# EasyEDA Pro project 长沙理工大学-NFC校园卡.epro

# Schematic Schematic1
Board Name: 编辑板; Create Date: 2025-08-29; Page Name: P1; Project Name: 长沙理工大学-NFC校园卡; Schematic Name: Schematic1; Update Date: 2025-09-23; Company: 嘉立创EDA; Drawed: lune; Page Size: A4; Part Number: lune; Reviewed: lune; Version: V1.0
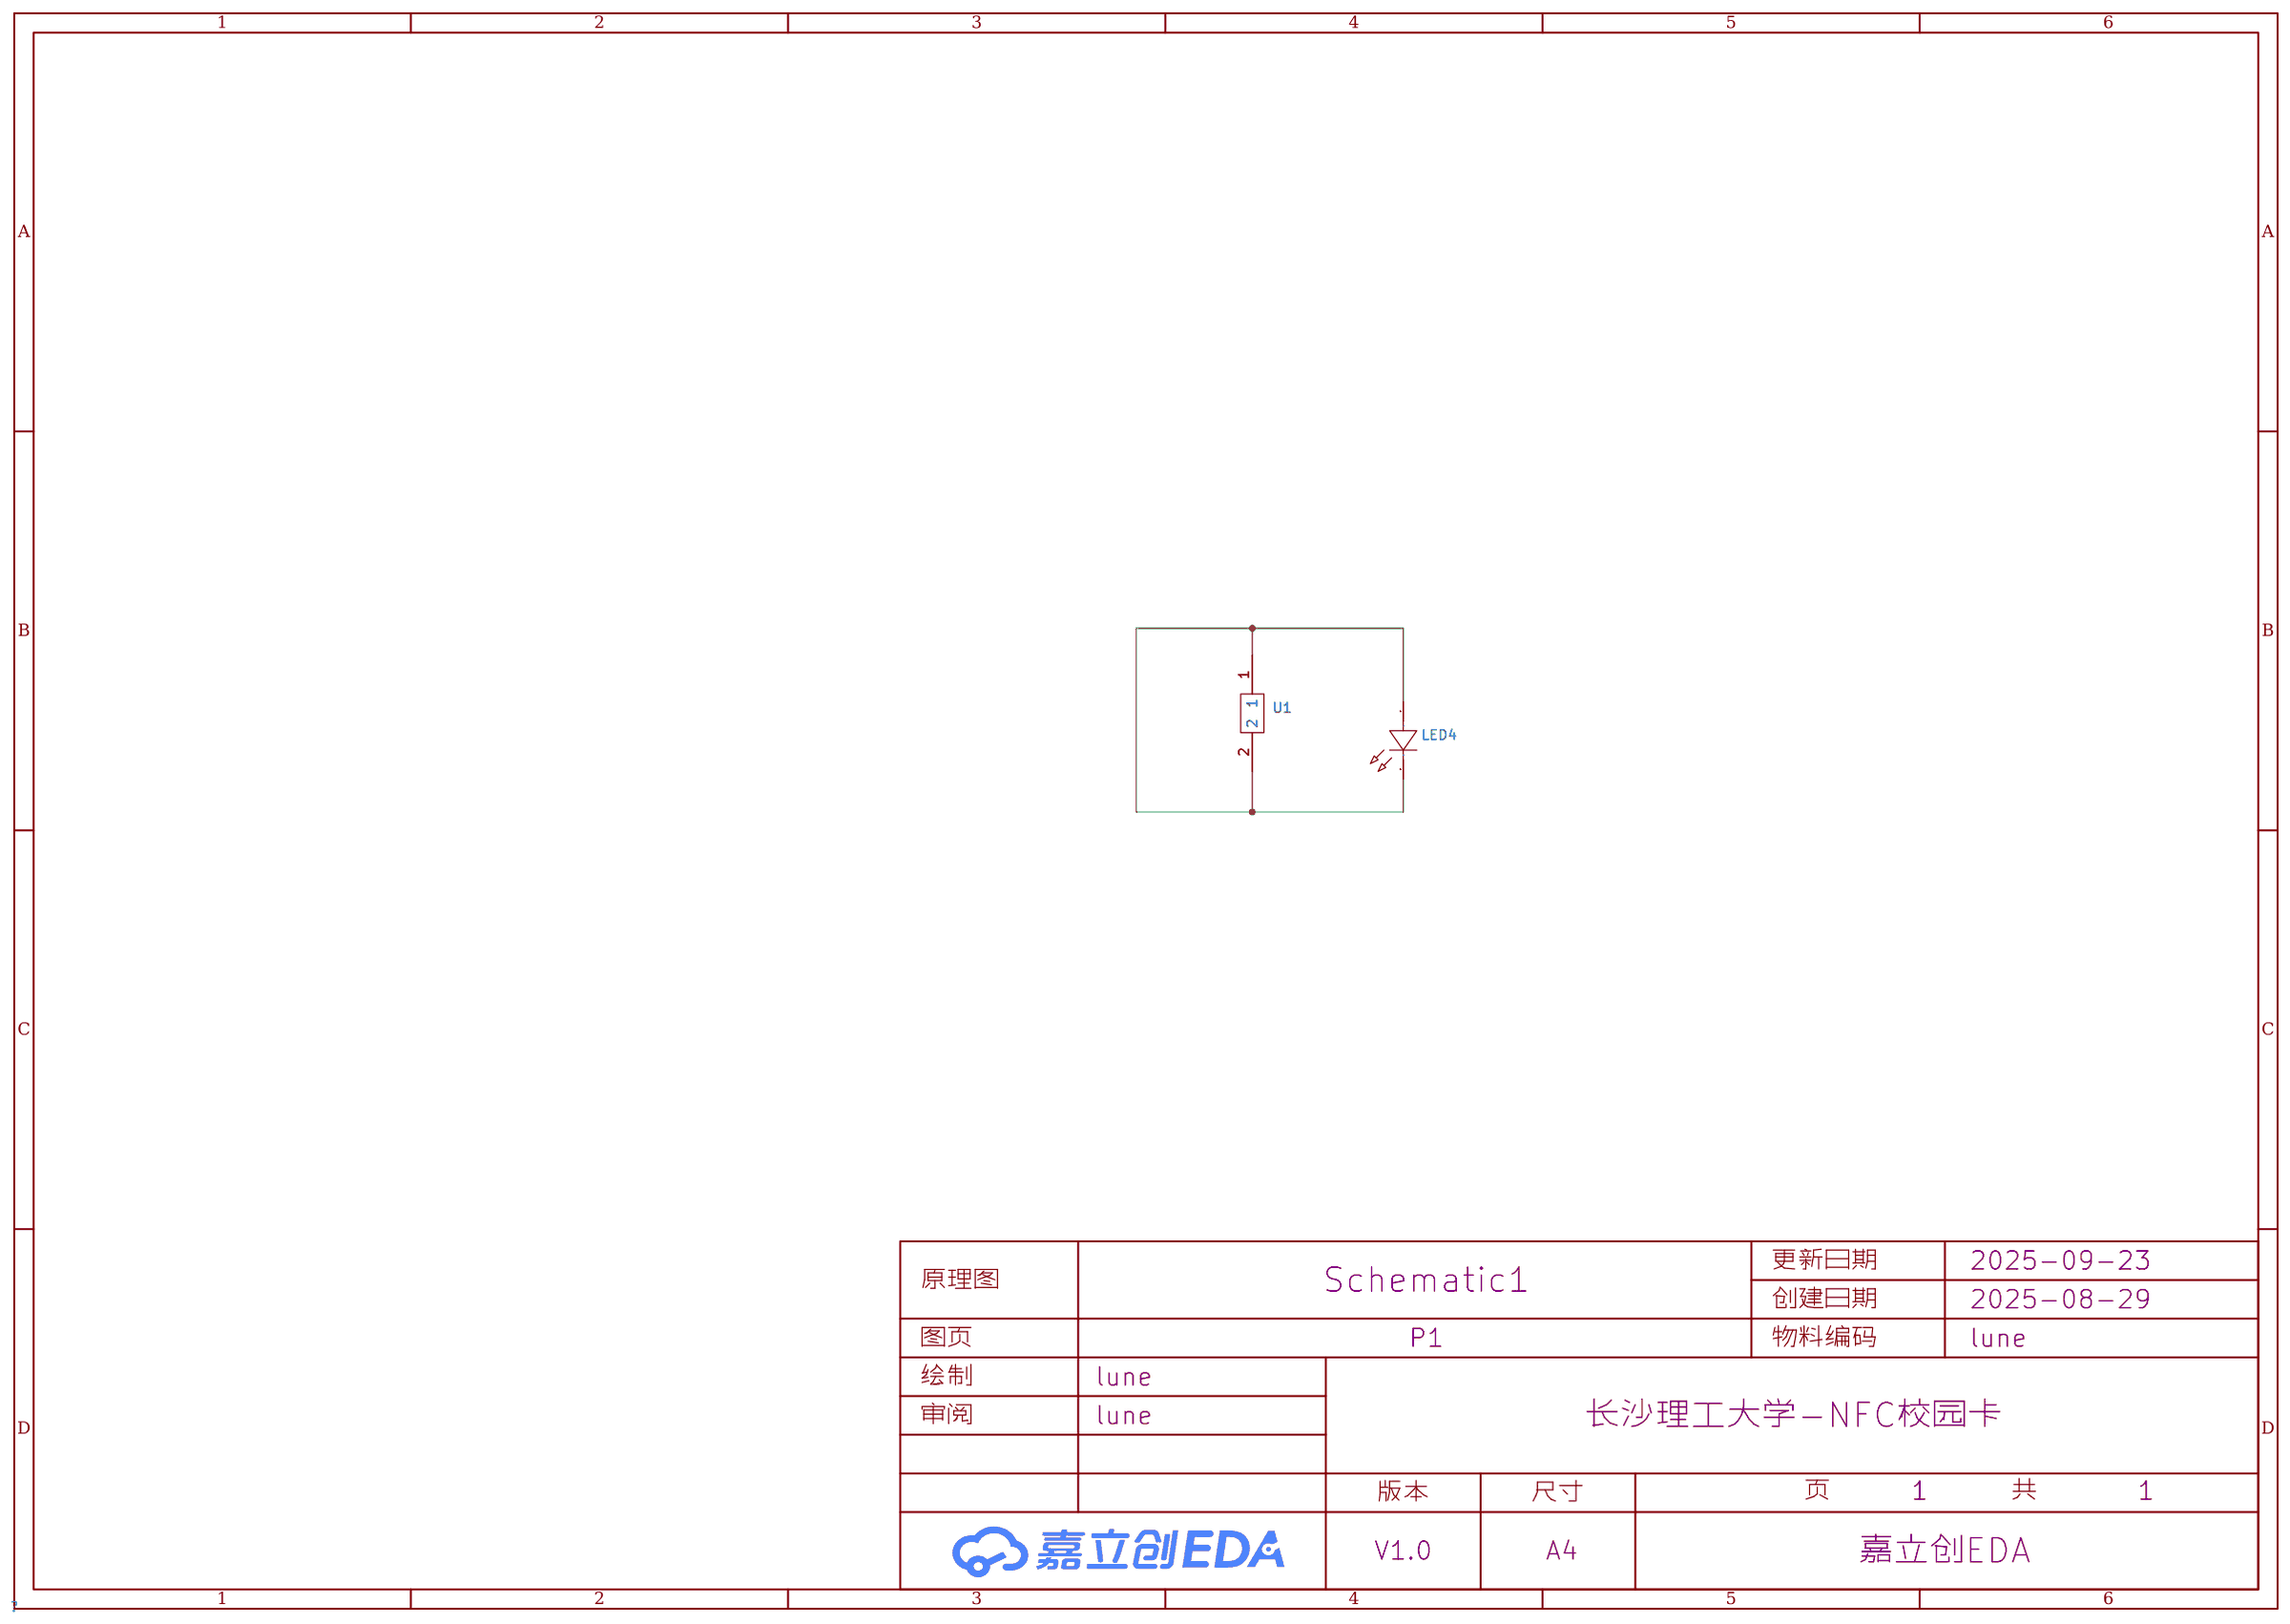
[diagram p0: schematic sheet]

## Parts
LED4  XL-3216SURC  [LED1206-R-RD_RED]
U1  CUID  [CUID芯片5×8mm]

## Library data of the parts
LED4 = XL-3216SURC: 发光颜色:红色;功率:55mW;正向电流:25mA;主波长:617nm~621nm;透镜颜色:无色透明透镜;色温:-;发光角度:120°;载带方式:正贴;工作温度:-30℃~+85℃;; Supplier Part: C965822; Manufacturer: XINGLIGHT(成兴光); Supplier Footprint: 1206; JLCPCB Part Class: 扩展库; Datasheet: https://atta.szlcsc.com/upload/public/pdf/source/20221102/38B682A5E5FDBBFCA7077B6272CE8E6F.pdf; Supplier: LCSC; Emitted Color: 红色; Power Dissipation: 55mW; Forward Current: 25mA; Dominant Wavelength: 617nm~621nm; Peak Wavelength: 623nm; Lens Color: 无色透明透镜; Viewing Angle: 120°; Mounting Sytle: 正贴; Operating Temperature: -30℃~+85℃
U1 = CUID芯片

## Nets
$1N1895: LED4.1(K) LED4.2(A) U1.1 U1.2

# Board PCB1
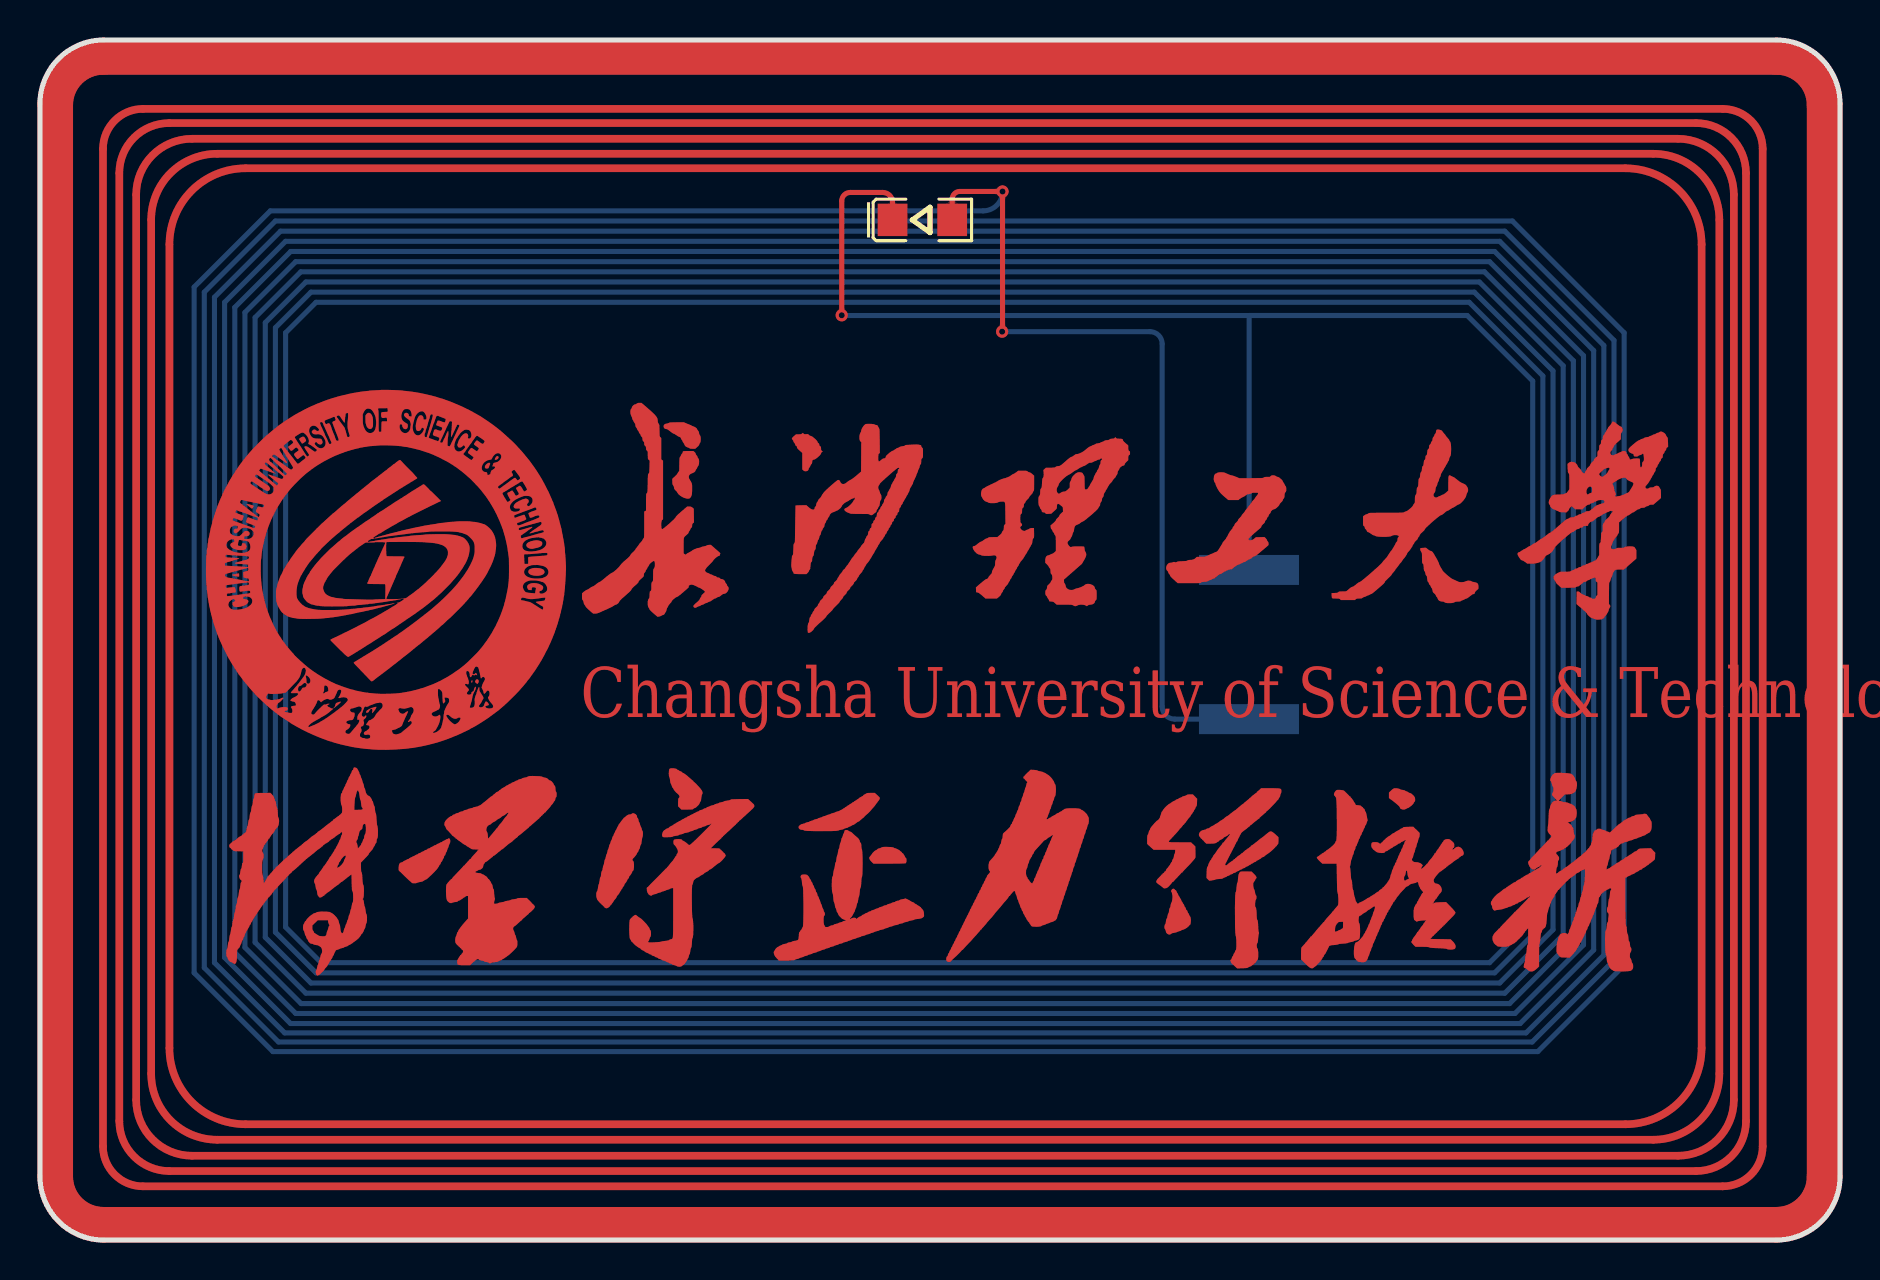
[diagram p1: board, top side]
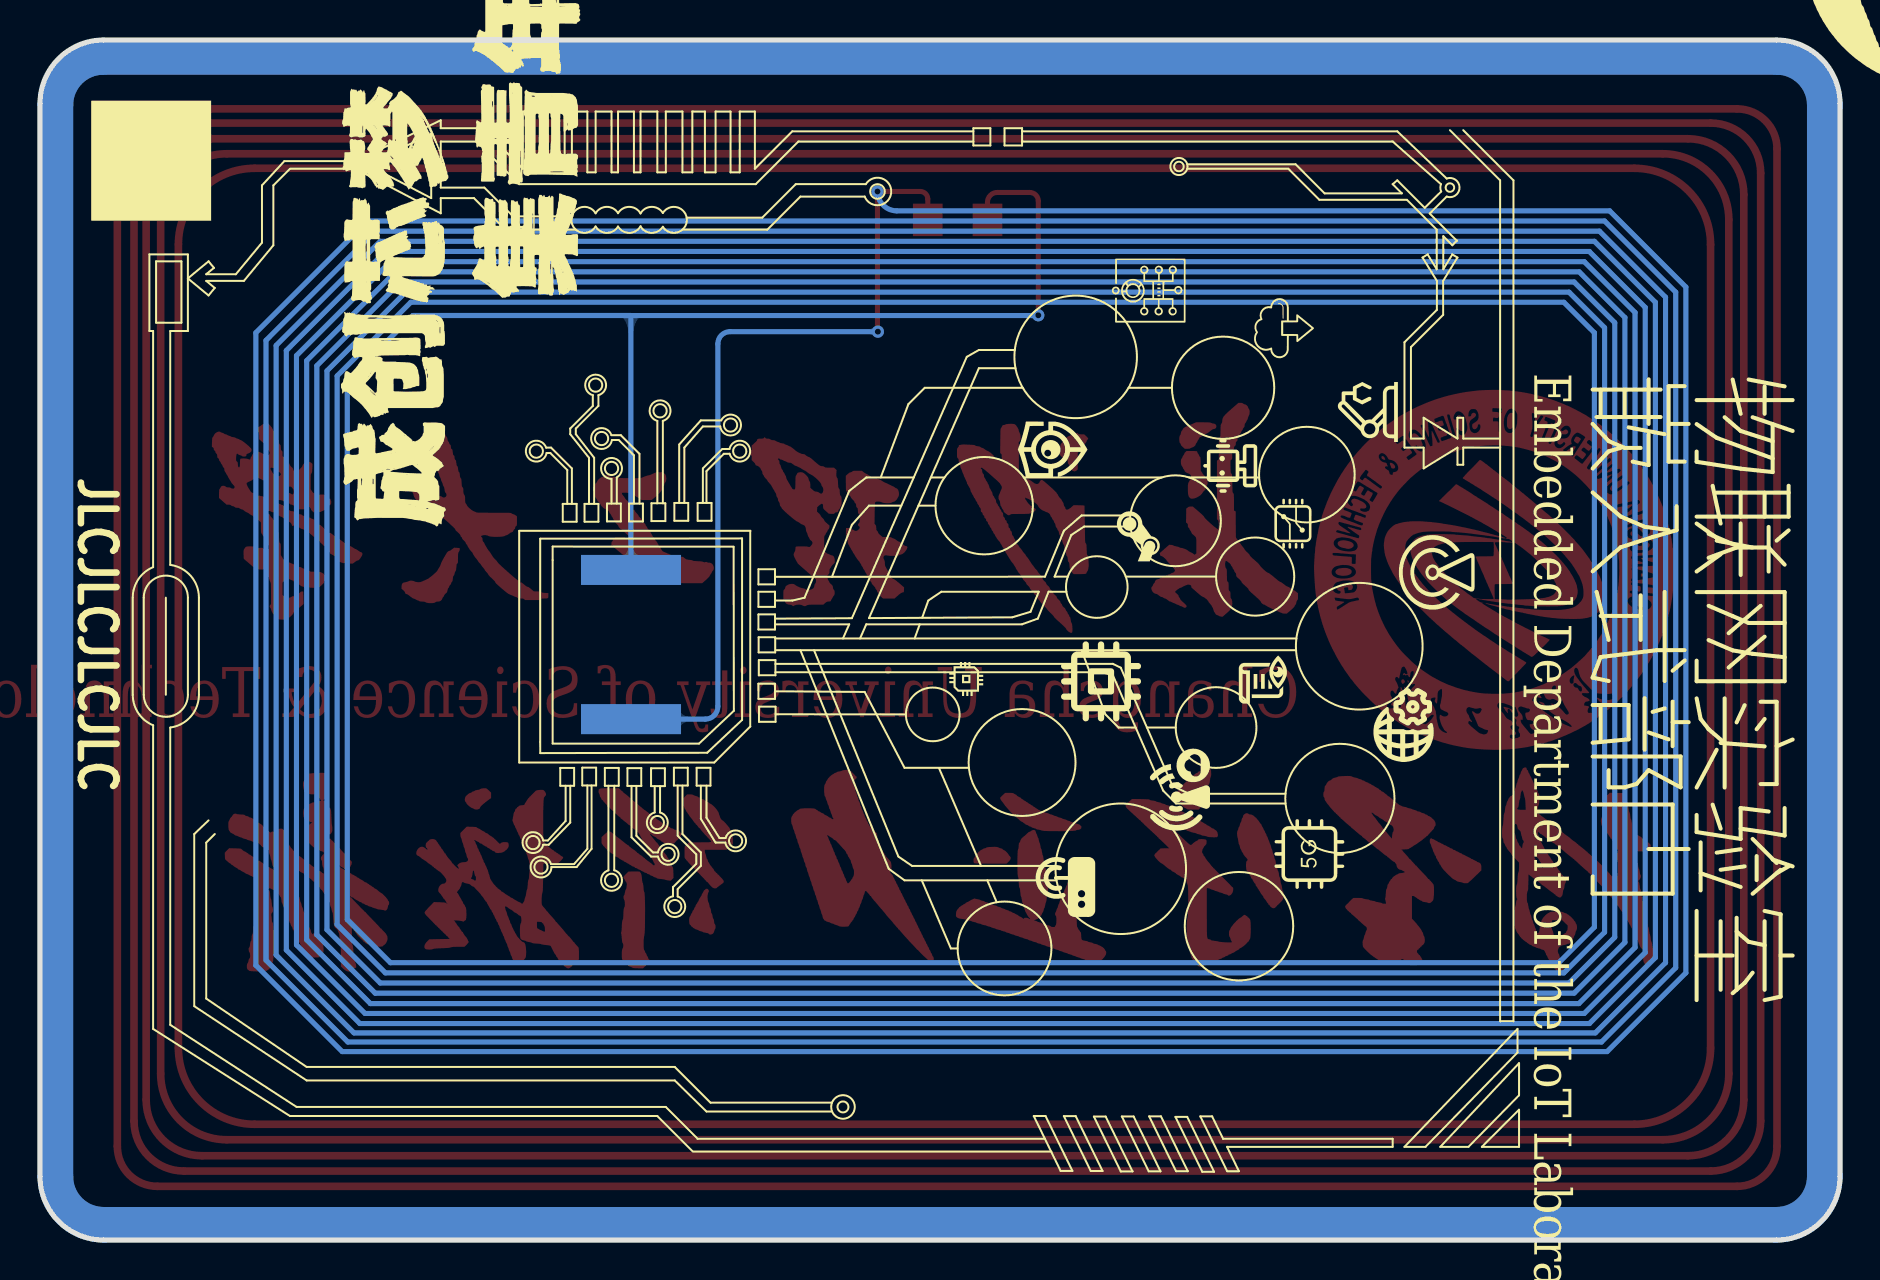
[diagram p2: board, bottom side, seen from below]

Outline 90 x 60 mm; copper layers: Top Layer, Bottom Layer. Coordinates in mm from the lower left corner of the outline.
Outline path: 0,56.82 arc(0.93,59.07) 3.18,60 86.82,60 arc(89.07,59.07) 90,56.82 90,3.18 arc(89.07,0.93) 86.82,0 3.18,0 arc(0.93,0.93) 0,3.18 0,56.82
Stack: Top Layer 0.035mm - / Dielectric1 1.51mm FR4 er 4.5 / Bottom Layer 0.035mm -

## Design rules (mm)
template: 自定义配置
spacing copperThickness1oz (default): track to track 0.203, other pairs 0.203 to 0.203
spacing copperThickness2oz: track to track 0.203, other pairs 0.152 to 0.3
track width copperThickness1oz (default): min 0.127, default 0.254, max 2.54
track width copperThickness2oz: min 0.203, default 0.254, max 2.54
differential pair differentialPair (default): width min 0.127, default 0.254, max 2.54; gap min 0.152, default 0.152
via viaSize (default): diameter min 0.5, default 0.61, max 10; hole min 0.3, default 0.305, max 6.299

## Placement (name value [footprint] x y rotation side)
LED4  XL-3216SURC  [LED1206-R-RD_RED]  44.12 51.01 0 top
U1  CUID  [JLC-QRCODE-6x6]  84.44 53.97 180 bottom
U1#2  -  [CUID芯片5×8mm]  60.45 29.77 90 bottom

## Footprints (pads in the part's own frame, mm; a bottom-side part is the same pattern mirrored in y, then rotated)
CUID芯片5×8mm
  rect 1.5x5 smd: 1(-3.729,0) 2(3.729,0)
LED1206-R-RD_RED
  rect 1.485x1.62 smd: 1(1.492,0) 2(-1.492,0)

## Nets
$1N1895: LED4.1 LED4.2 U1#2.1 U1#2.2

## Via types
v1: diameter 0.61, hole 0.305, Top Layer to Bottom Layer, 3 vias

## Routing (per net, layer and track width the routed paths; a pad name or vN(x,y) marks a point on that pad's centre or on a via; arc(x,y) is an arc through that point)
$1N1895: length 2079.2
  Top Layer w0.254: LED4.2 42.63,51.89 arc(42.48,52.23) 42.14,52.38 40.51,52.38 arc(40.21,52.25) 40.09,51.95 v1(40.09,46.24) ; v1(48.11,45.42) 48.13,45.44 v1(48.13,52.43) 45.99,52.43 arc(45.72,52.32) 45.61,52.05 LED4.1
  Bottom Layer w0.254: 48.09,52.47 48.09,52.47 ; U1#2.1 56.74,26.04 arc(56.29,26.23) 56.11,26.67 56.11,44.81 arc(55.93,45.24) 55.5,45.42 v1(48.11,45.42) ; v1(40.09,46.24) 40.1,46.22 60.46,46.22 ; U1#2.2 60.46,33.51 60.46,46.22 71.36,46.22 74.64,42.95 74.64,16.02 72.48,13.87 14.06,13.87 12.28,15.64 12.28,45.36 13.8,46.89 71.46,46.89 75.14,43.2 75.14,15.77 72.73,13.36 13.8,13.36 11.77,15.39 11.77,45.62 13.55,47.39 71.72,47.39 75.65,43.46 75.65,15.52 72.99,12.85 13.55,12.85 11.26,15.14 11.26,45.87 13.3,47.9 71.97,47.9 76.16,43.71 76.16,15.26 73.24,12.34 13.3,12.34 10.75,14.88 10.75,46.12 13.04,48.41 72.22,48.41 76.67,43.96 76.67,15.01 73.48,11.82 13.05,11.82 10.25,14.63 10.25,46.38 12.79,48.92 72.48,48.92 77.18,44.22 77.18,14.75 73.75,11.33 12.79,11.33 9.74,14.37 9.74,46.63 12.53,49.43 72.73,49.43 77.68,44.47 77.68,14.5 74.01,10.82 12.53,10.82 9.23,14.12 9.23,46.89 12.28,49.93 72.99,49.93 78.19,44.73 78.19,14.25 74.3,10.35 12.23,10.35 8.72,13.87 8.72,47.14 12.03,50.44 73.24,50.44 78.7,44.98 78.7,13.99 74.61,9.9 11.93,9.9 8.22,13.61 8.22,47.39 11.77,50.95 73.62,50.95 79.21,45.36 79.21,13.74 74.89,9.42 11.64,9.42 7.71,13.36 7.71,47.65 11.52,51.46 47.16,51.46 arc(47.84,51.74) v1(48.13,52.43)

Small or netless copper shapes (teardrops, artwork), in the pictures only: 50 on Top Layer, 6 on Bottom Layer

## Text on the board
Bottom Silkscreen Layer: JLCJLCJLCJLC | Embedded Department of the IoT Laboratory | 物联网实验室 | 嵌入式部门
Top Layer: Changsha University of Science & Technology
Top Solder Mask Layer: Changsha University of Science & Technology

# Board 第一版
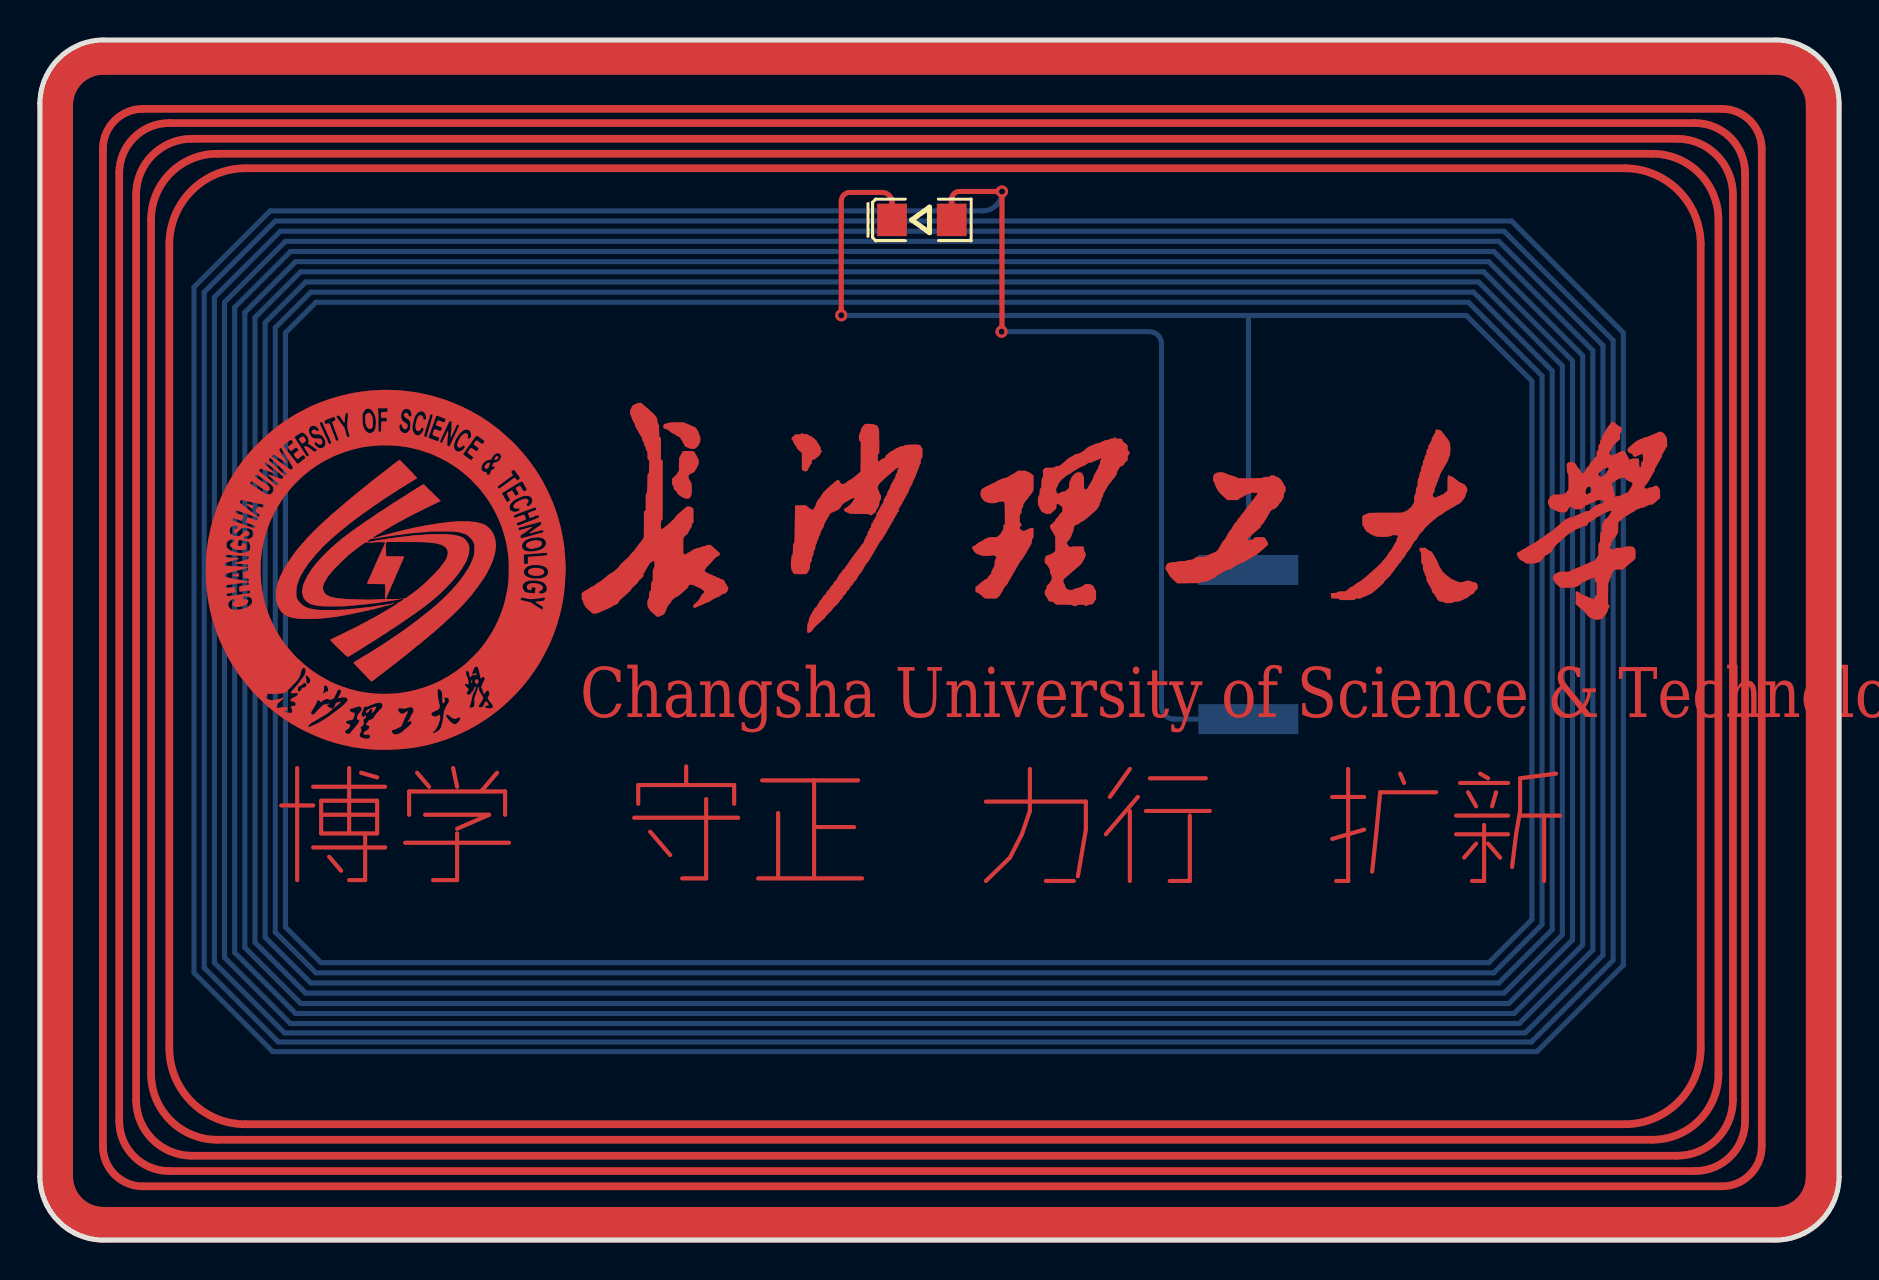
[diagram p3: board, top side]
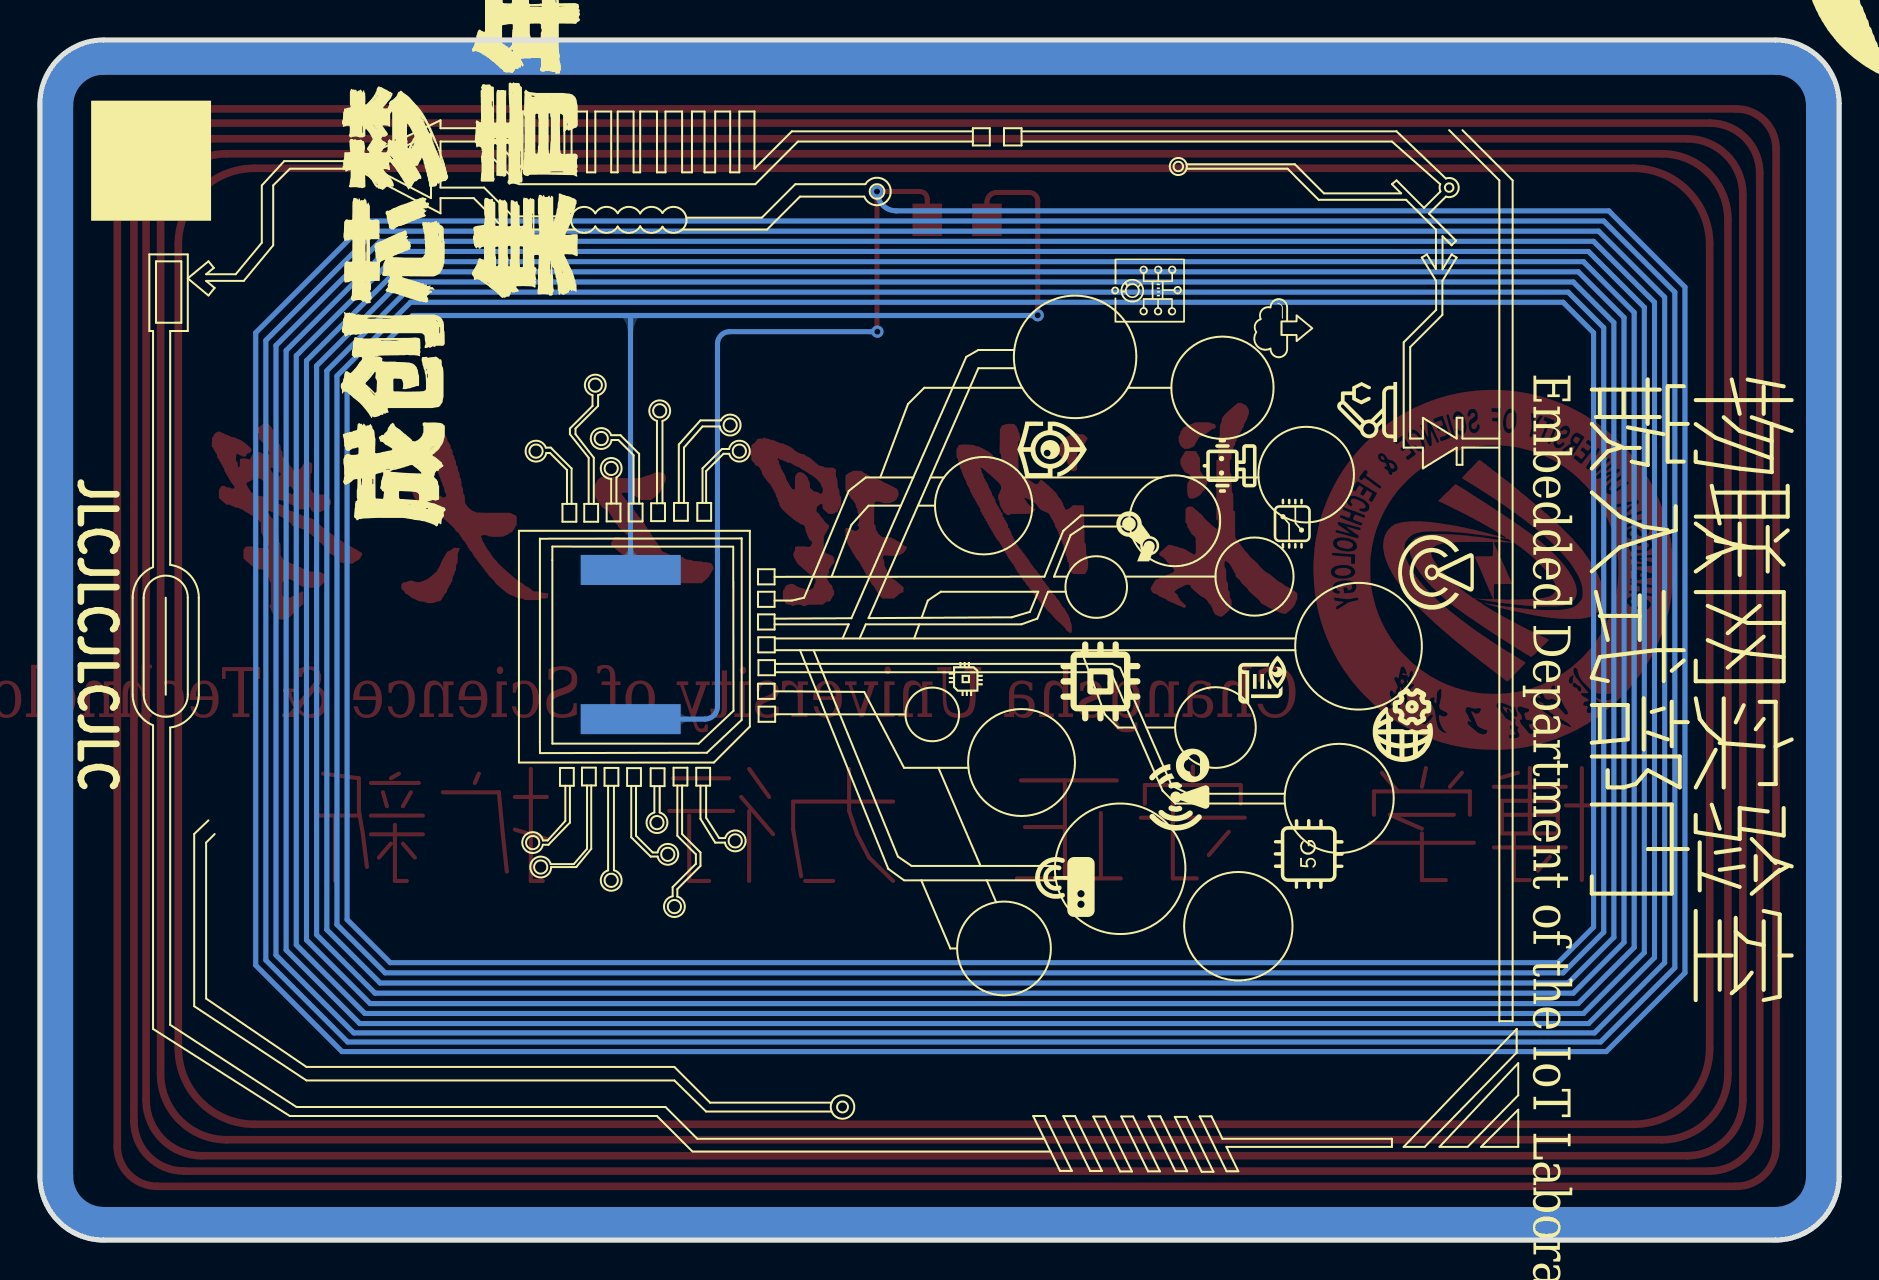
[diagram p4: board, bottom side, seen from below]

Outline 90 x 60 mm; copper layers: Top Layer, Bottom Layer. Coordinates in mm from the lower left corner of the outline.
Outline path: 0,56.82 arc(0.93,59.07) 3.18,60 86.82,60 arc(89.07,59.07) 90,56.82 90,3.18 arc(89.07,0.93) 86.82,0 3.18,0 arc(0.93,0.93) 0,3.18 0,56.82
Stack: Top Layer 0.035mm - / Dielectric1 1.51mm FR4 er 4.5 / Bottom Layer 0.035mm -

## Design rules (mm)
template: 自定义配置
spacing copperThickness1oz (default): track to track 0.203, other pairs 0.203 to 0.203
spacing copperThickness2oz: track to track 0.203, other pairs 0.152 to 0.3
track width copperThickness1oz (default): min 0.127, default 0.254, max 2.54
track width copperThickness2oz: min 0.203, default 0.254, max 2.54
differential pair differentialPair (default): width min 0.127, default 0.254, max 2.54; gap min 0.152, default 0.152
via viaSize (default): diameter min 0.5, default 0.61, max 10; hole min 0.3, default 0.305, max 6.299

## Placement (name value [footprint] x y rotation side)
LED4  XL-3216SURC  [LED1206-R-RD_RED]  44.12 51.01 0 top
U1  -  [CUID芯片5×8mm]  60.45 29.77 90 bottom
U1#2  -  [JLC-QRCODE-6x6]  84.44 53.96 180 bottom

## Footprints (pads in the part's own frame, mm; a bottom-side part is the same pattern mirrored in y, then rotated)
CUID芯片5×8mm
  rect 1.5x5 smd: 1(-3.729,0) 2(3.729,0)
LED1206-R-RD_RED
  rect 1.485x1.62 smd: 1(1.492,0) 2(-1.492,0)

## Nets
$1N1895: LED4.1 LED4.2 U1.1 U1.2

## Via types
v1: diameter 0.61, hole 0.305, Top Layer to Bottom Layer, 3 vias

## Routing (per net, layer and track width the routed paths; a pad name or vN(x,y) marks a point on that pad's centre or on a via; arc(x,y) is an arc through that point)
$1N1895: length 2079.2
  Top Layer w0.254: v1(48.11,45.42) 48.13,45.44 v1(48.13,52.43) 45.99,52.43 arc(45.72,52.31) 45.61,52.05 LED4.1 ; v1(40.09,46.24) 40.09,51.95 arc(40.21,52.25) 40.51,52.38 42.14,52.38 arc(42.48,52.23) 42.63,51.89 LED4.2
  Bottom Layer w0.254: U1.2 60.46,33.51 60.46,46.23 ; v1(48.11,45.42) 55.5,45.42 arc(55.93,45.24) 56.11,44.81 56.11,26.67 arc(56.29,26.23) 56.73,26.04 U1.1 ; 60.46,46.23 40.1,46.23 v1(40.09,46.24) ; 60.46,46.23 71.36,46.23 74.64,42.95 74.64,16.02 72.48,13.87 14.06,13.87 12.28,15.64 12.28,45.36 13.8,46.89 71.46,46.89 75.14,43.2 75.14,15.77 72.73,13.36 13.8,13.36 11.77,15.39 11.77,45.62 13.55,47.39 71.71,47.39 75.65,43.46 75.65,15.52 72.98,12.85 13.55,12.85 11.26,15.14 11.26,45.87 13.29,47.9 71.97,47.9 76.16,43.71 76.16,15.26 73.24,12.34 13.29,12.34 10.75,14.88 10.75,46.12 13.04,48.41 72.22,48.41 76.67,43.96 76.67,15.01 73.48,11.82 13.05,11.82 10.25,14.63 10.25,46.38 12.79,48.92 72.48,48.92 77.18,44.22 77.18,14.75 73.75,11.33 12.79,11.33 9.74,14.37 9.74,46.63 12.53,49.43 72.73,49.43 77.68,44.47 77.68,14.5 74.01,10.82 12.53,10.82 9.23,14.12 9.23,46.89 12.28,49.93 72.98,49.93 78.19,44.73 78.19,14.25 74.3,10.36 12.23,10.36 8.72,13.87 8.72,47.14 12.02,50.44 73.24,50.44 78.7,44.98 78.7,13.99 74.61,9.9 11.93,9.9 8.21,13.61 8.21,47.39 11.77,50.95 73.62,50.95 79.21,45.36 79.21,13.74 74.89,9.42 11.64,9.42 7.71,13.36 7.71,47.65 11.52,51.46 47.16,51.46 arc(47.84,51.74) v1(48.13,52.43) ; 48.09,52.47 48.09,52.47

Small or netless copper shapes (teardrops, artwork), in the pictures only: 33 on Top Layer, 6 on Bottom Layer

## Text on the board
Bottom Silkscreen Layer: JLCJLCJLCJLC | Embedded Department of the IoT Laboratory | 物联网实验室 | 嵌入式部门
Top Layer: Changsha University of Science & Technology | 博学 | 守正 | 力行 | 扩新
Top Solder Mask Layer: Changsha University of Science & Technology | 博学 | 守正 | 力行 | 扩新

# Board 第二版
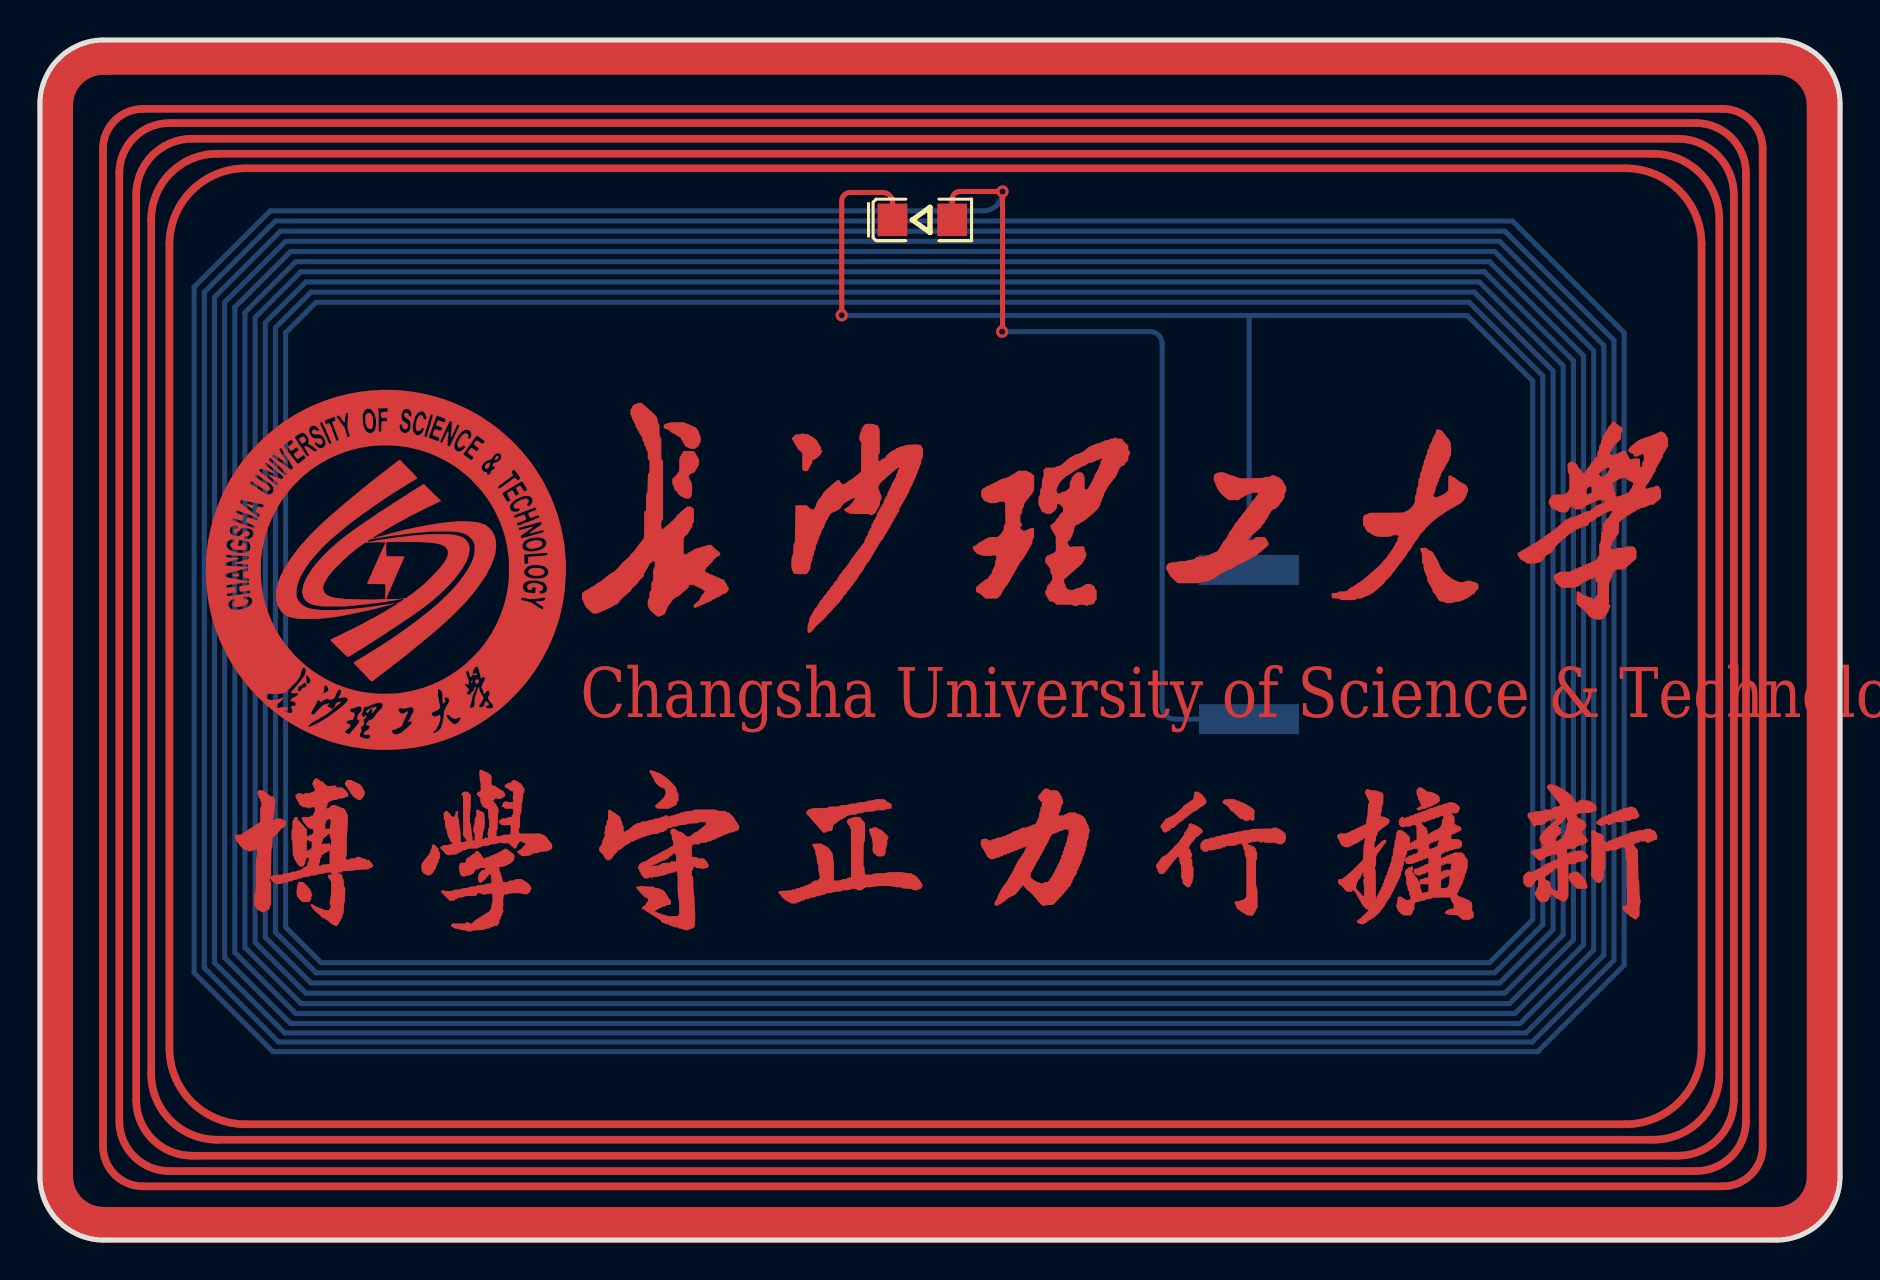
[diagram p5: board, top side]
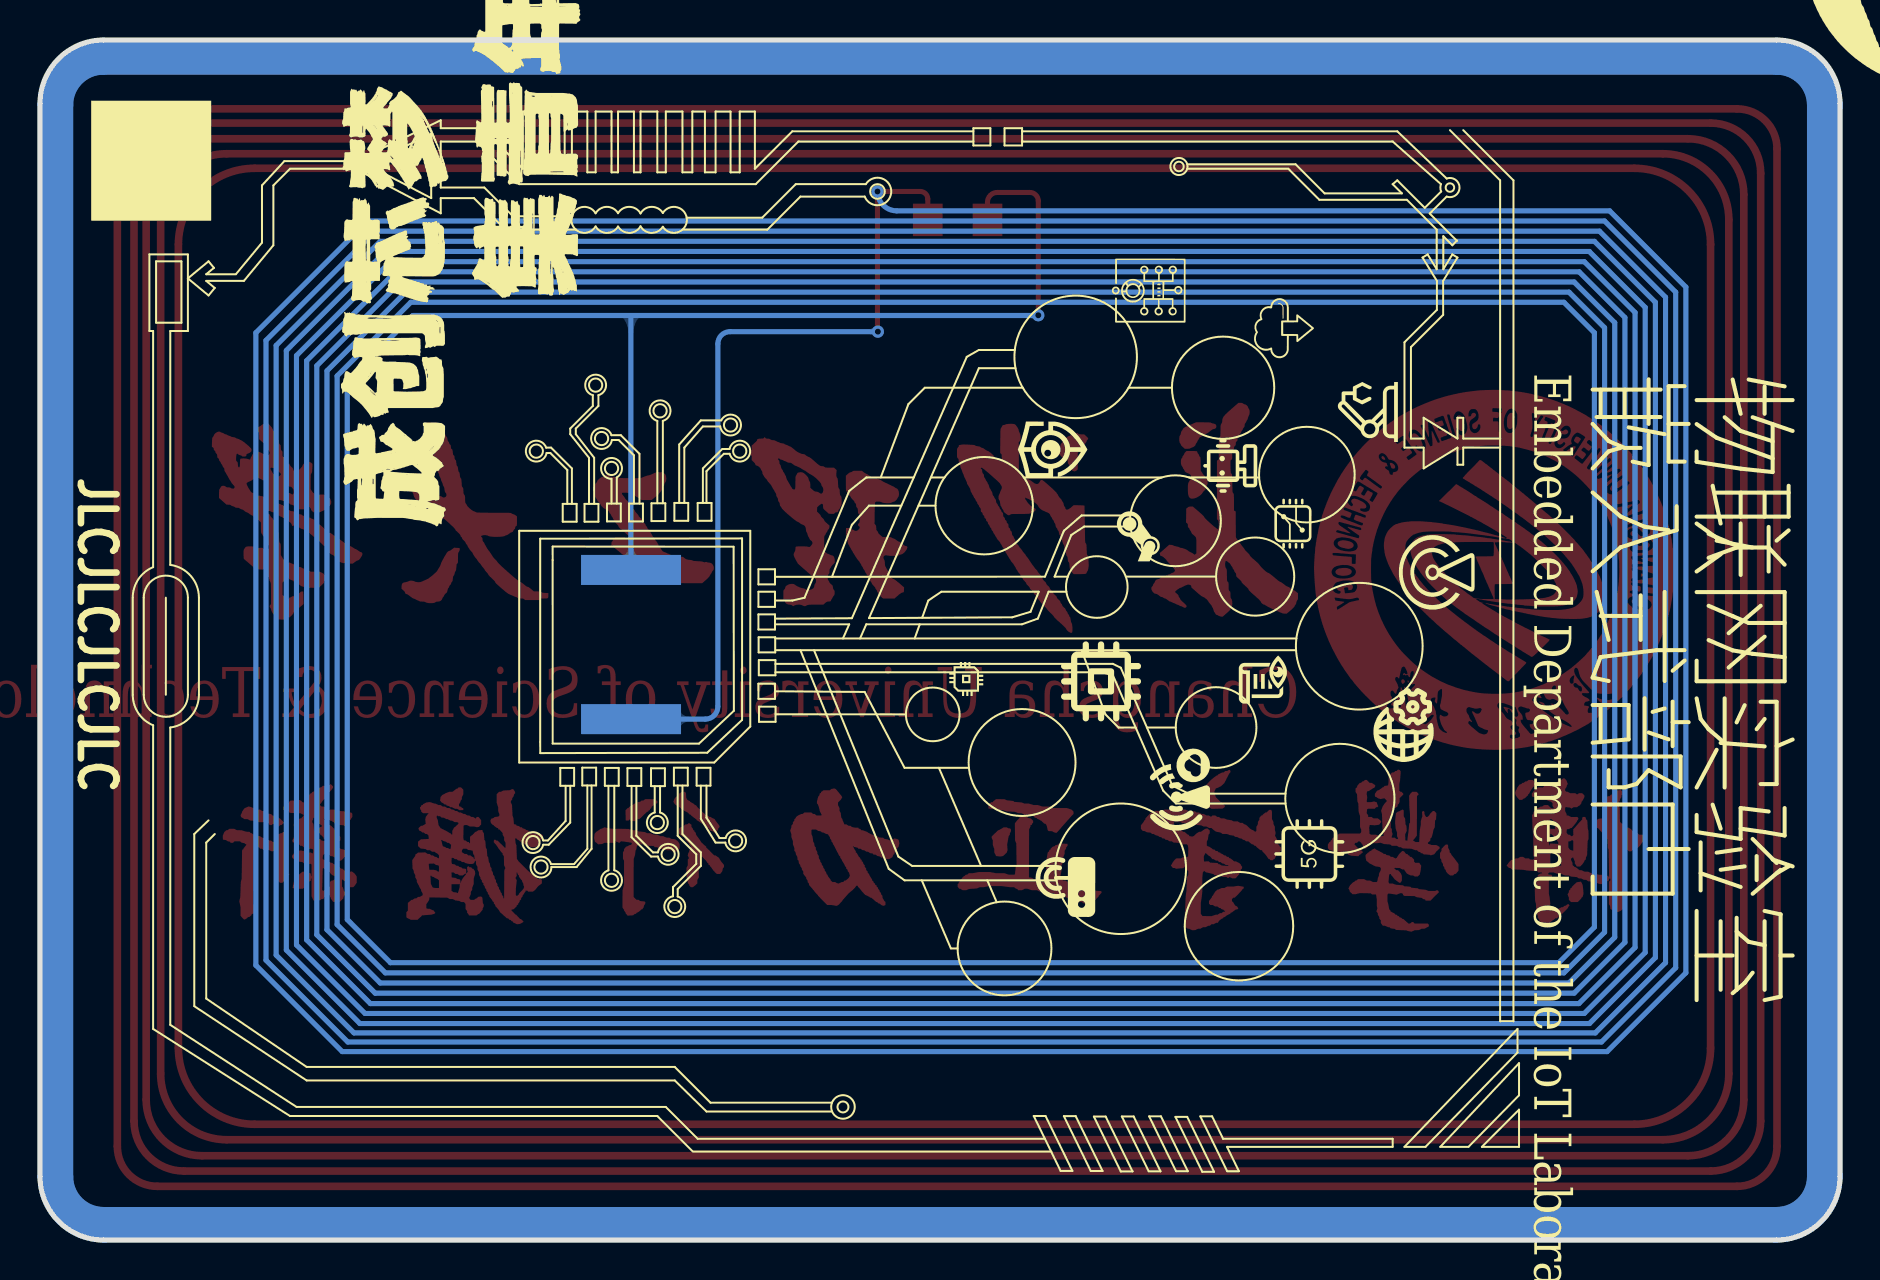
[diagram p6: board, bottom side, seen from below]

Outline 90 x 60 mm; copper layers: Top Layer, Bottom Layer. Coordinates in mm from the lower left corner of the outline.
Outline path: 0,56.82 arc(0.93,59.07) 3.18,60 86.82,60 arc(89.07,59.07) 90,56.82 90,3.18 arc(89.07,0.93) 86.82,0 3.18,0 arc(0.93,0.93) 0,3.18 0,56.82
Stack: Top Layer 0.035mm - / Dielectric1 1.51mm FR4 er 4.5 / Bottom Layer 0.035mm -

## Design rules (mm)
template: 自定义配置
spacing copperThickness1oz (default): track to track 0.203, other pairs 0.203 to 0.203
spacing copperThickness2oz: track to track 0.203, other pairs 0.152 to 0.3
track width copperThickness1oz (default): min 0.127, default 0.254, max 2.54
track width copperThickness2oz: min 0.203, default 0.254, max 2.54
differential pair differentialPair (default): width min 0.127, default 0.254, max 2.54; gap min 0.152, default 0.152
via viaSize (default): diameter min 0.5, default 0.61, max 10; hole min 0.3, default 0.305, max 6.299

## Placement (name value [footprint] x y rotation side)
LED4  XL-3216SURC  [LED1206-R-RD_RED]  44.12 51.01 0 top
U1  -  [JLC-QRCODE-6x6]  84.44 53.96 180 bottom
U1#2  -  [CUID芯片5×8mm]  60.45 29.77 90 bottom

## Footprints (pads in the part's own frame, mm; a bottom-side part is the same pattern mirrored in y, then rotated)
CUID芯片5×8mm
  rect 1.5x5 smd: 1(-3.729,0) 2(3.729,0)
LED1206-R-RD_RED
  rect 1.485x1.62 smd: 1(1.492,0) 2(-1.492,0)

## Nets
$1N1895: LED4.1 LED4.2 U1#2.1 U1#2.2

## Via types
v1: diameter 0.61, hole 0.305, Top Layer to Bottom Layer, 3 vias

## Routing (per net, layer and track width the routed paths; a pad name or vN(x,y) marks a point on that pad's centre or on a via; arc(x,y) is an arc through that point)
$1N1895: length 2079.2
  Top Layer w0.254: LED4.1 45.61,52.05 arc(45.72,52.31) 45.99,52.43 v1(48.13,52.43) 48.13,45.44 v1(48.11,45.42) ; v1(40.09,46.24) 40.09,51.95 arc(40.21,52.25) 40.51,52.38 42.14,52.38 arc(42.48,52.23) 42.63,51.89 LED4.2
  Bottom Layer w0.254: 48.09,52.47 48.09,52.47 ; 60.46,46.22 71.36,46.22 74.64,42.95 74.64,16.02 72.48,13.87 14.06,13.87 12.28,15.64 12.28,45.36 13.8,46.89 71.46,46.89 75.14,43.2 75.14,15.77 72.73,13.36 13.8,13.36 11.77,15.39 11.77,45.62 13.55,47.39 71.71,47.39 75.65,43.46 75.65,15.52 72.98,12.85 13.55,12.85 11.26,15.14 11.26,45.87 13.3,47.9 71.97,47.9 76.16,43.71 76.16,15.26 73.24,12.34 13.3,12.34 10.76,14.88 10.76,46.12 13.04,48.41 72.22,48.41 76.67,43.96 76.67,15.01 73.48,11.82 13.05,11.82 10.25,14.63 10.25,46.38 12.79,48.92 72.48,48.92 77.18,44.22 77.18,14.75 73.75,11.33 12.79,11.33 9.74,14.37 9.74,46.63 12.53,49.43 72.73,49.43 77.68,44.47 77.68,14.5 74.01,10.82 12.53,10.82 9.23,14.12 9.23,46.89 12.28,49.93 72.98,49.93 78.19,44.73 78.19,14.25 74.3,10.35 12.23,10.35 8.72,13.87 8.72,47.14 12.03,50.44 73.24,50.44 78.7,44.98 78.7,13.99 74.61,9.9 11.93,9.9 8.22,13.61 8.22,47.39 11.77,50.95 73.62,50.95 79.21,45.36 79.21,13.74 74.89,9.42 11.64,9.42 7.71,13.36 7.71,47.65 11.52,51.46 47.16,51.46 arc(47.84,51.74) v1(48.13,52.43) ; 60.46,46.22 60.46,33.51 U1#2.2 ; 60.46,46.22 40.1,46.22 v1(40.09,46.24) ; v1(48.11,45.42) 55.5,45.42 arc(55.93,45.24) 56.11,44.81 56.11,26.67 arc(56.29,26.23) 56.73,26.04 U1#2.1

Small or netless copper shapes (teardrops, artwork), in the pictures only: 54 on Top Layer, 6 on Bottom Layer

## Text on the board
Bottom Silkscreen Layer: JLCJLCJLCJLC | Embedded Department of the IoT Laboratory | 物联网实验室 | 嵌入式部门
Top Layer: Changsha University of Science & Technology
Top Solder Mask Layer: Changsha University of Science & Technology

# Board 第三版
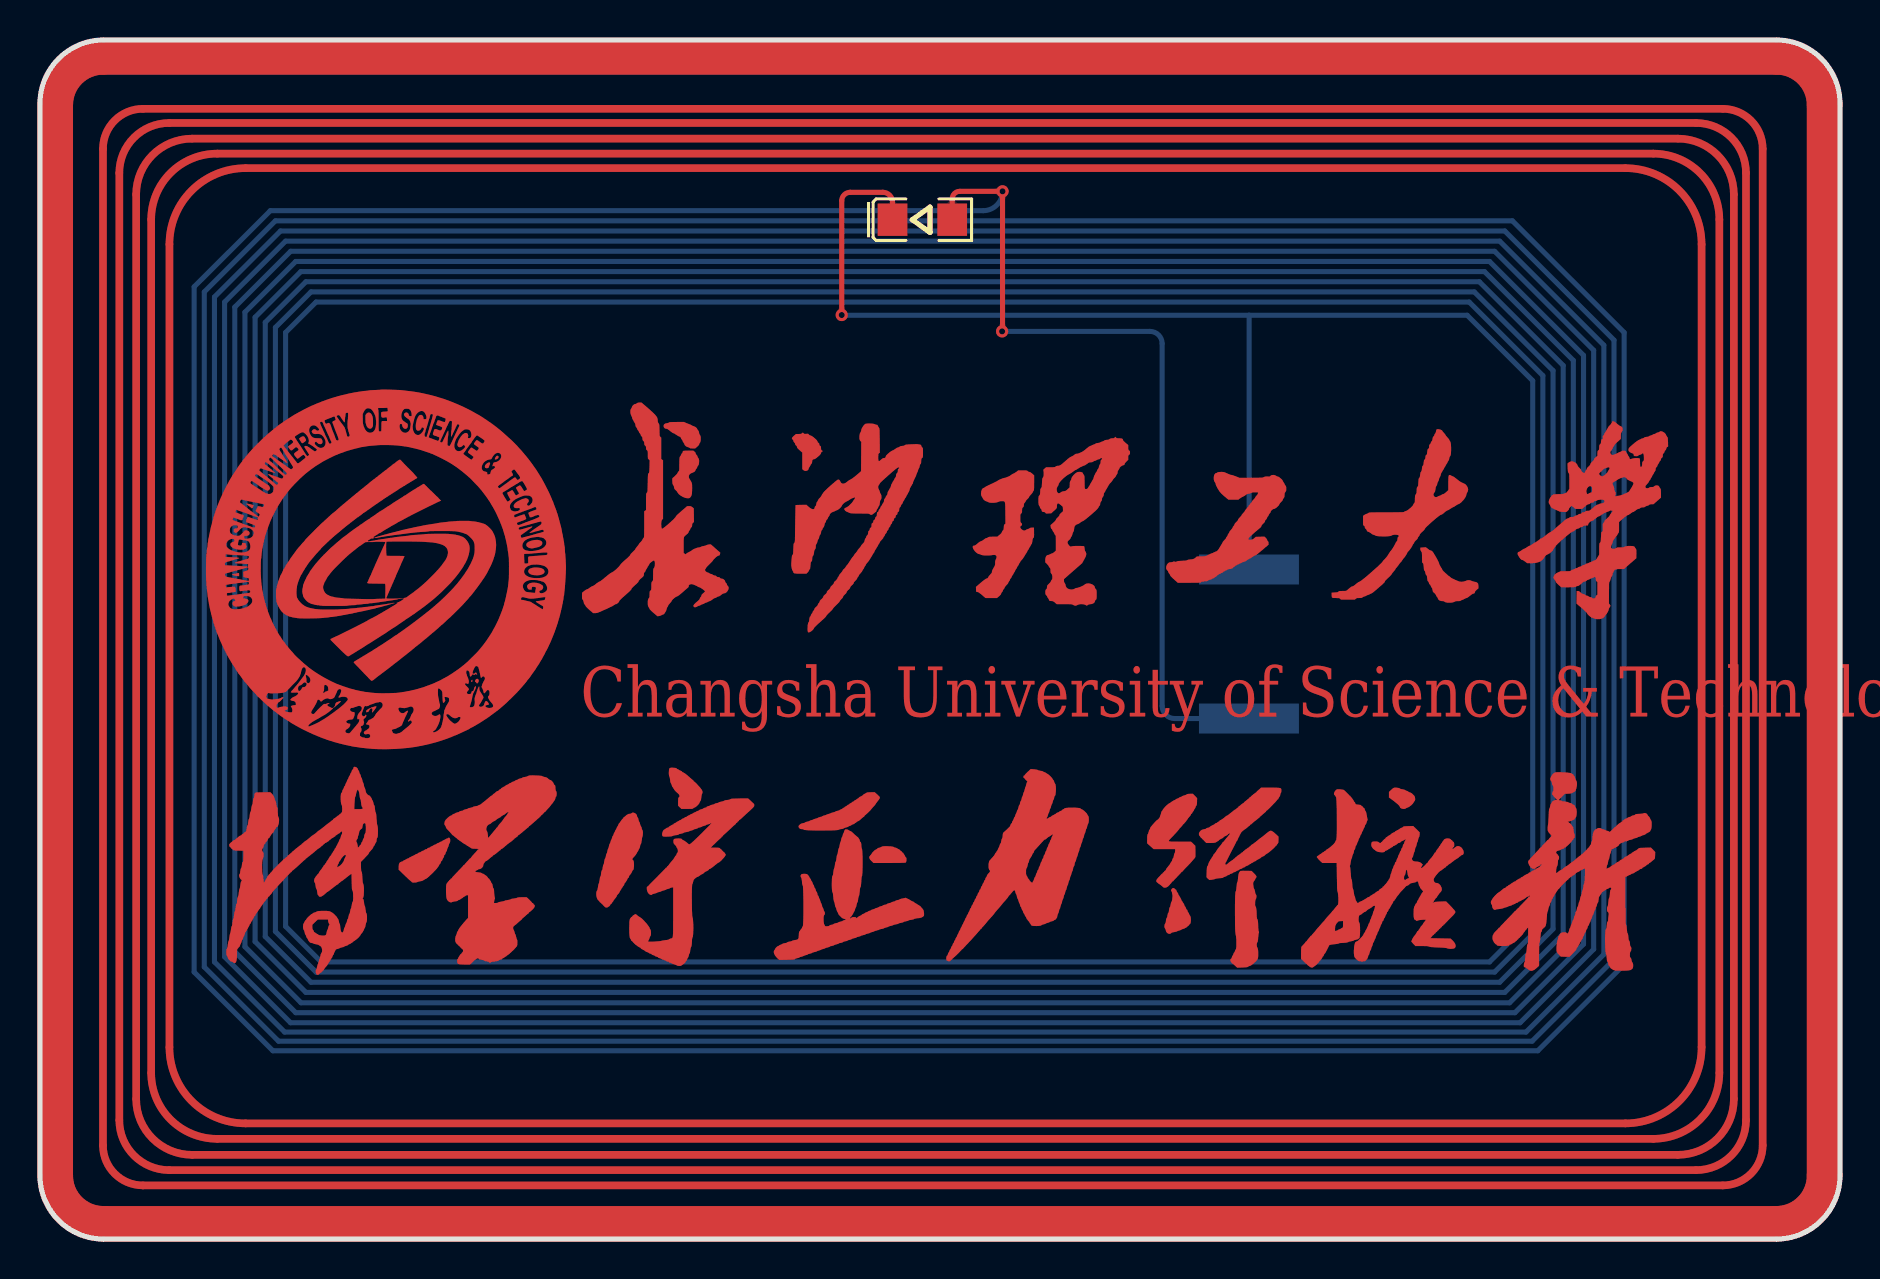
[diagram p7: board, top side]
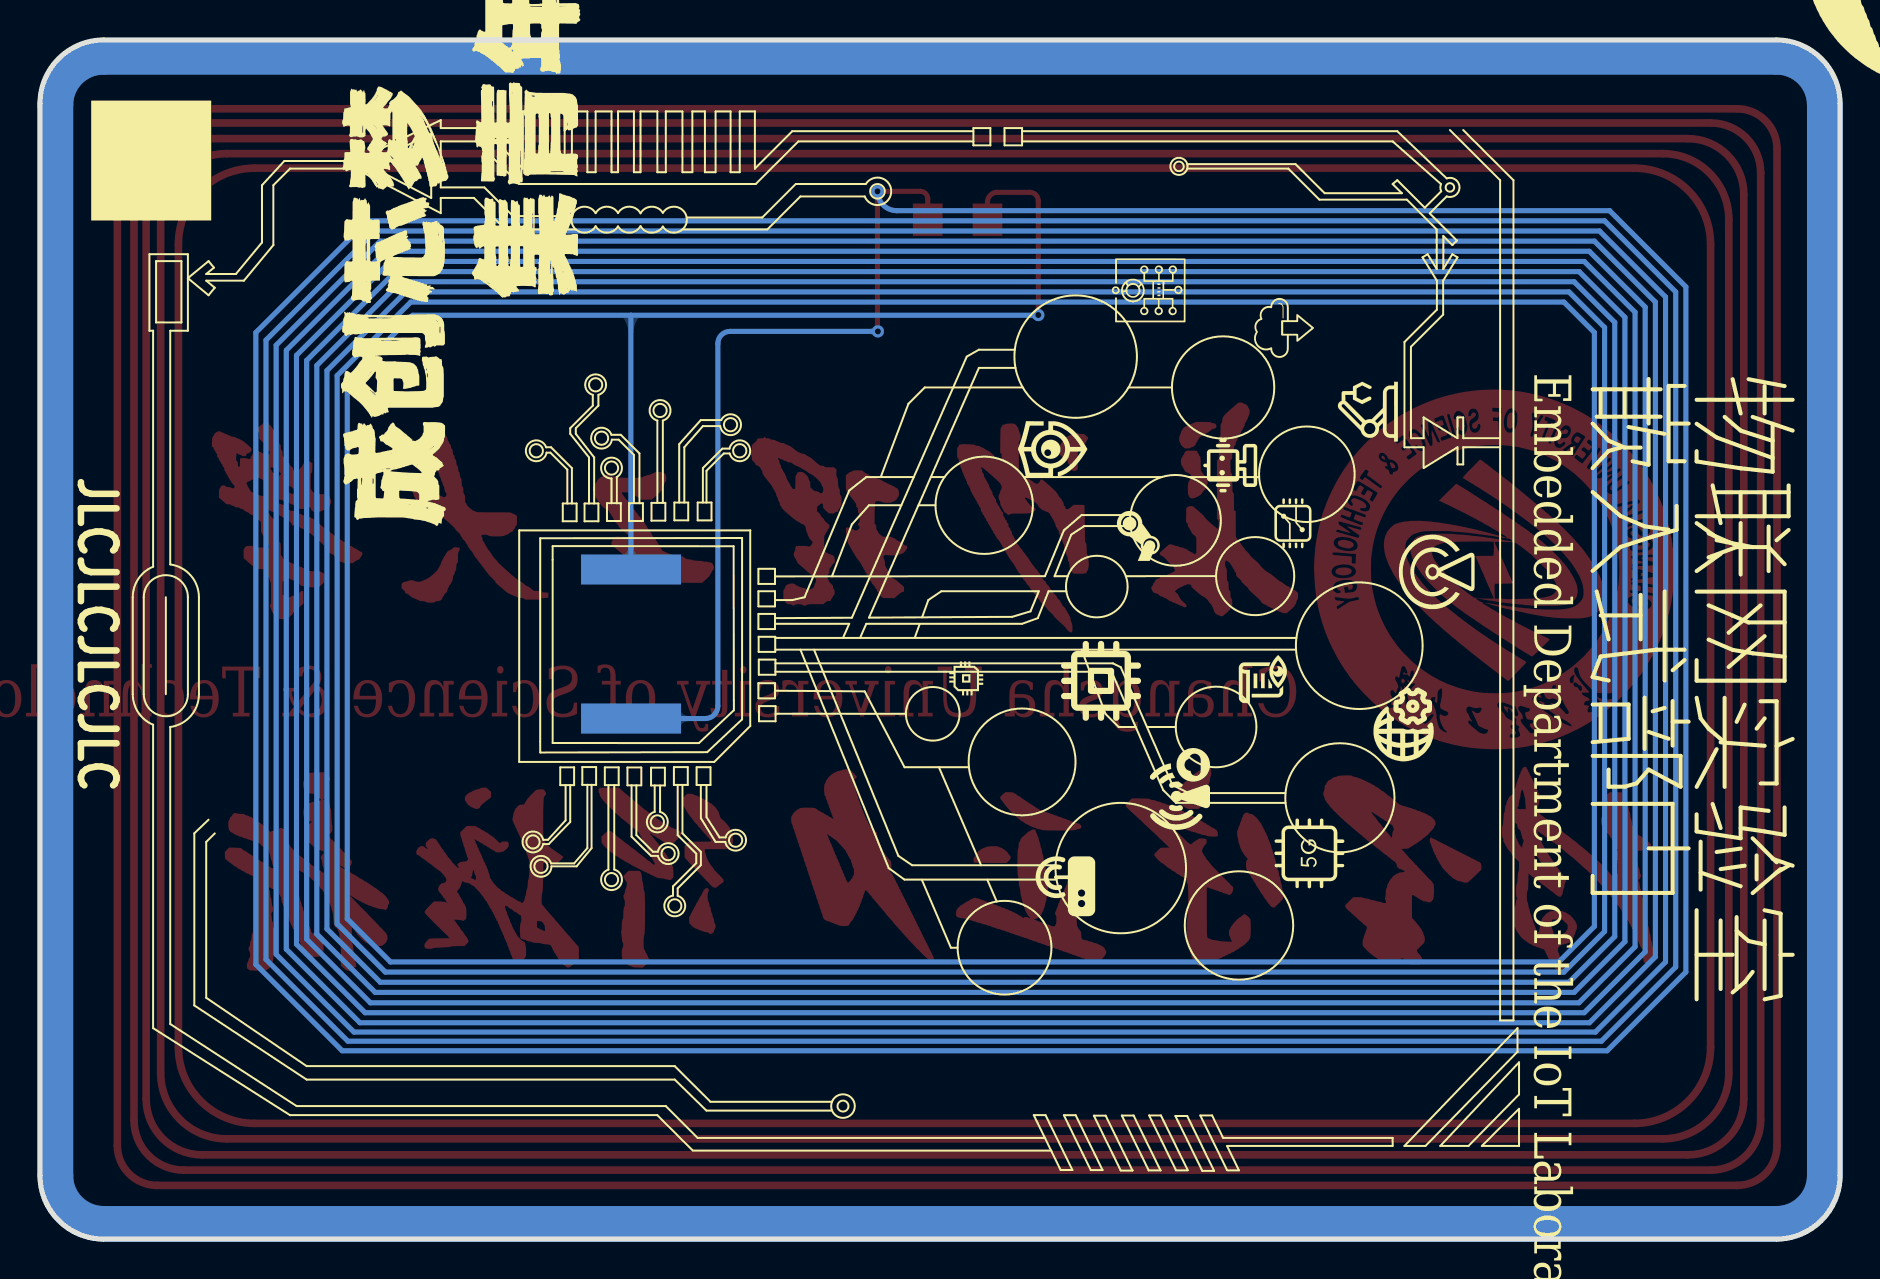
[diagram p8: board, bottom side, seen from below]

Outline 90 x 60 mm; copper layers: Top Layer, Bottom Layer. Coordinates in mm from the lower left corner of the outline.
Outline path: 0,56.82 arc(0.93,59.07) 3.18,60 86.82,60 arc(89.07,59.07) 90,56.82 90,3.18 arc(89.07,0.93) 86.82,0 3.18,0 arc(0.93,0.93) 0,3.18 0,56.82
Stack: Top Layer 0.035mm - / Dielectric1 1.51mm FR4 er 4.5 / Bottom Layer 0.035mm -

## Design rules (mm)
template: 自定义配置
spacing copperThickness1oz (default): track to track 0.203, other pairs 0.203 to 0.203
spacing copperThickness2oz: track to track 0.203, other pairs 0.152 to 0.3
track width copperThickness1oz (default): min 0.127, default 0.254, max 2.54
track width copperThickness2oz: min 0.203, default 0.254, max 2.54
differential pair differentialPair (default): width min 0.127, default 0.254, max 2.54; gap min 0.152, default 0.152
via viaSize (default): diameter min 0.5, default 0.61, max 10; hole min 0.3, default 0.305, max 6.299

## Placement (name value [footprint] x y rotation side)
LED4  XL-3216SURC  [LED1206-R-RD_RED]  44.12 51.01 0 top
U1  -  [CUID芯片5×8mm]  60.45 29.77 90 bottom
U1#2  -  [JLC-QRCODE-6x6]  84.44 53.96 180 bottom

## Footprints (pads in the part's own frame, mm; a bottom-side part is the same pattern mirrored in y, then rotated)
CUID芯片5×8mm
  rect 1.5x5 smd: 1(-3.729,0) 2(3.729,0)
LED1206-R-RD_RED
  rect 1.485x1.62 smd: 1(1.492,0) 2(-1.492,0)

## Nets
$1N1895: LED4.1 LED4.2 U1.1 U1.2

## Via types
v1: diameter 0.61, hole 0.305, Top Layer to Bottom Layer, 3 vias

## Routing (per net, layer and track width the routed paths; a pad name or vN(x,y) marks a point on that pad's centre or on a via; arc(x,y) is an arc through that point)
$1N1895: length 2079.2
  Top Layer w0.254: LED4.1 45.61,52.05 arc(45.72,52.31) 45.99,52.43 v1(48.13,52.43) 48.13,45.44 v1(48.11,45.42) ; LED4.2 42.63,51.89 arc(42.48,52.23) 42.14,52.38 40.51,52.38 arc(40.21,52.25) 40.09,51.95 v1(40.09,46.24)
  Bottom Layer w0.254: 60.46,46.23 40.1,46.23 v1(40.09,46.24) ; 60.46,46.23 60.46,33.51 U1.2 ; 60.46,46.23 71.36,46.23 74.64,42.95 74.64,16.02 72.48,13.87 14.06,13.87 12.28,15.64 12.28,45.36 13.8,46.89 71.46,46.89 75.14,43.2 75.14,15.77 72.73,13.36 13.8,13.36 11.77,15.39 11.77,45.62 13.55,47.39 71.72,47.39 75.65,43.46 75.65,15.52 72.99,12.85 13.55,12.85 11.26,15.14 11.26,45.87 13.3,47.9 71.97,47.9 76.16,43.71 76.16,15.26 73.24,12.34 13.3,12.34 10.76,14.88 10.76,46.12 13.04,48.41 72.22,48.41 76.67,43.96 76.67,15.01 73.48,11.82 13.05,11.82 10.25,14.63 10.25,46.38 12.79,48.92 72.48,48.92 77.18,44.22 77.18,14.75 73.75,11.33 12.79,11.33 9.74,14.37 9.74,46.63 12.53,49.43 72.73,49.43 77.68,44.47 77.68,14.5 74.01,10.82 12.53,10.82 9.23,14.12 9.23,46.89 12.28,49.93 72.99,49.93 78.19,44.73 78.19,14.25 74.3,10.35 12.23,10.35 8.72,13.87 8.72,47.14 12.03,50.44 73.24,50.44 78.7,44.98 78.7,13.99 74.61,9.9 11.93,9.9 8.22,13.61 8.22,47.39 11.77,50.95 73.62,50.95 79.21,45.36 79.21,13.74 74.89,9.42 11.64,9.42 7.71,13.36 7.71,47.65 11.52,51.46 47.16,51.46 arc(47.84,51.74) v1(48.13,52.43) ; 48.09,52.47 48.09,52.47 ; U1.1 56.74,26.04 arc(56.29,26.23) 56.11,26.67 56.11,44.81 arc(55.93,45.24) 55.5,45.42 v1(48.11,45.42)

Small or netless copper shapes (teardrops, artwork), in the pictures only: 50 on Top Layer, 6 on Bottom Layer

## Text on the board
Bottom Silkscreen Layer: JLCJLCJLCJLC | Embedded Department of the IoT Laboratory | 物联网实验室 | 嵌入式部门
Top Layer: Changsha University of Science & Technology
Top Solder Mask Layer: Changsha University of Science & Technology

# Board PCB1_1
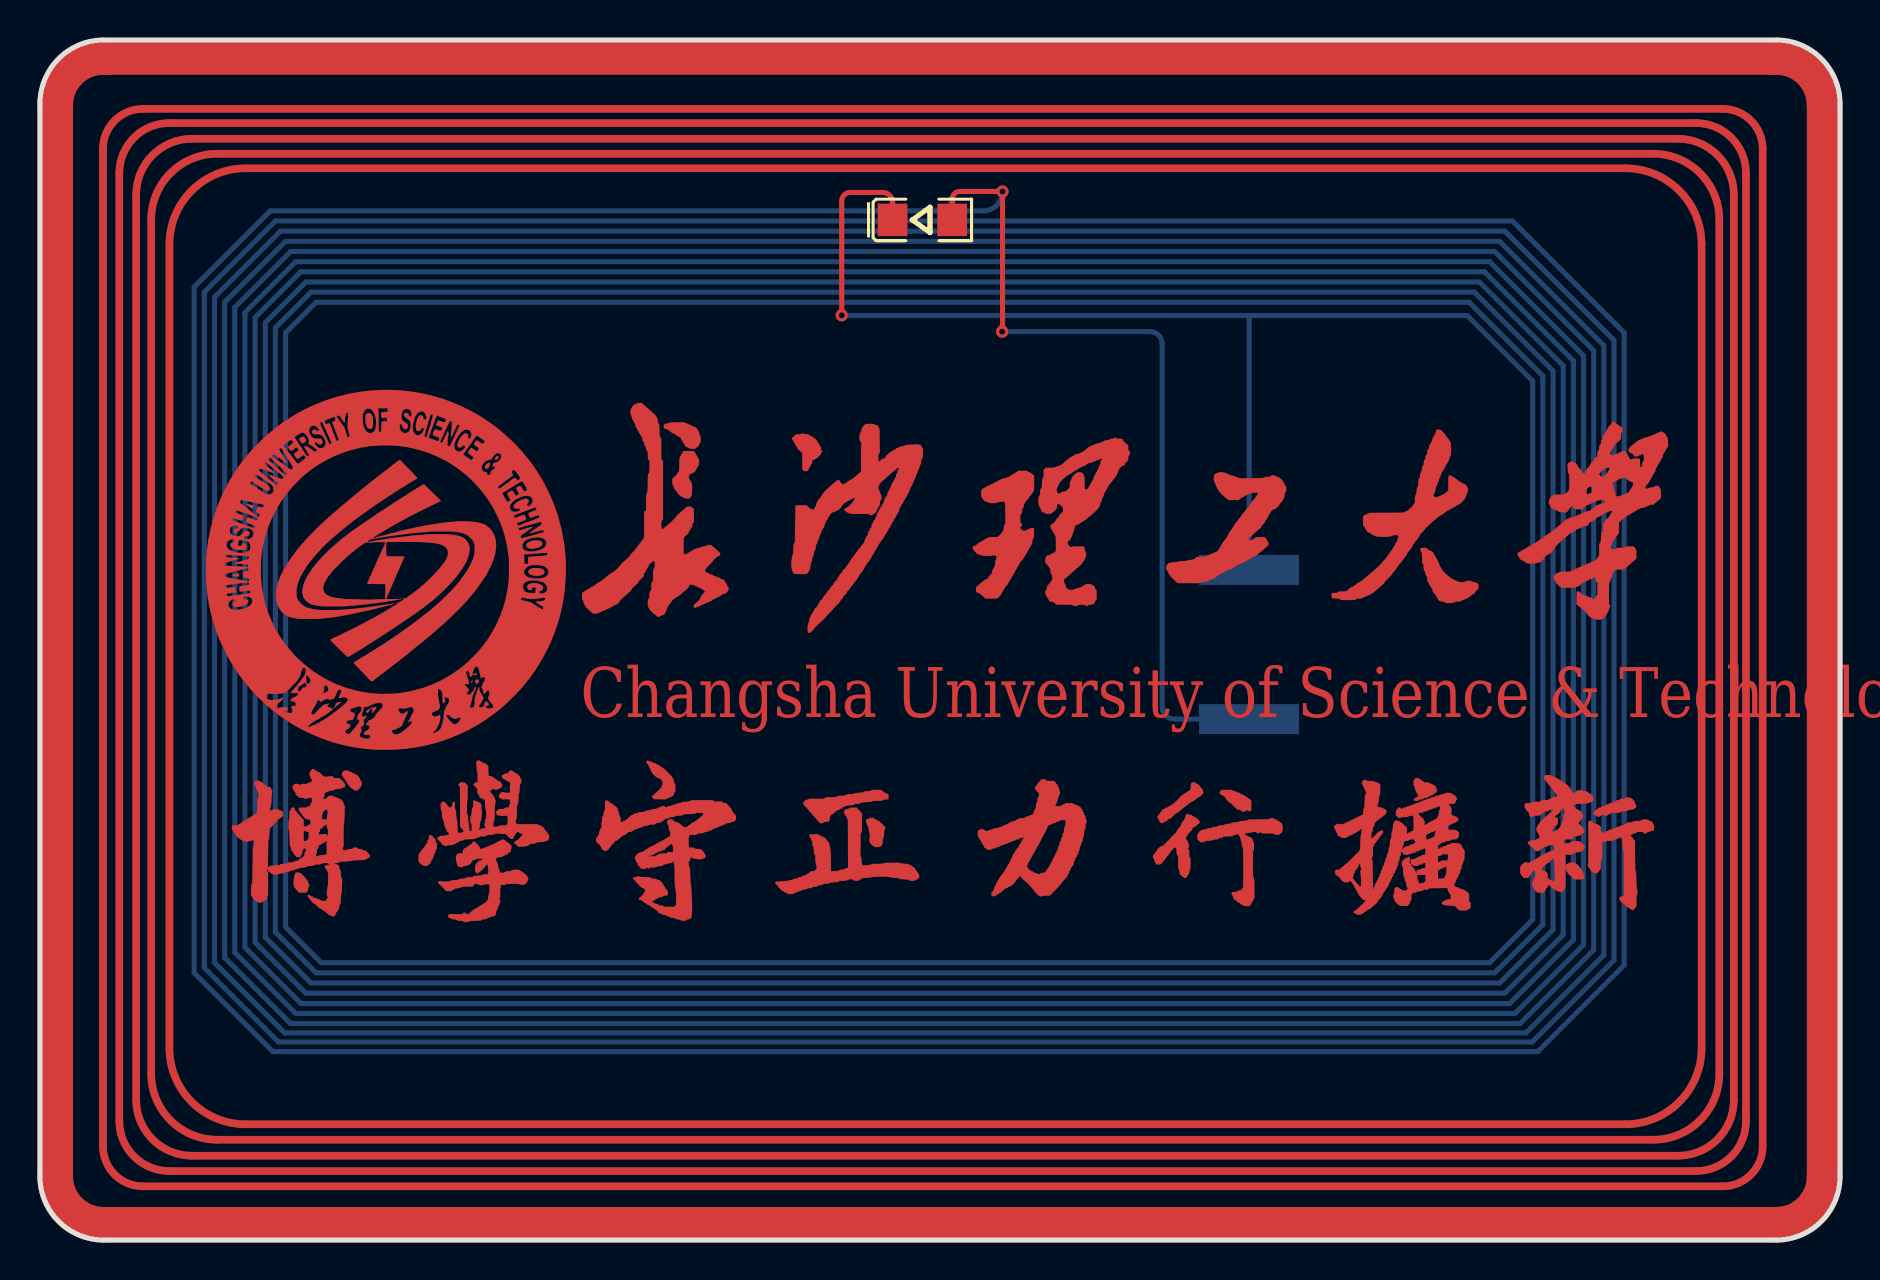
[diagram p9: board, top side]
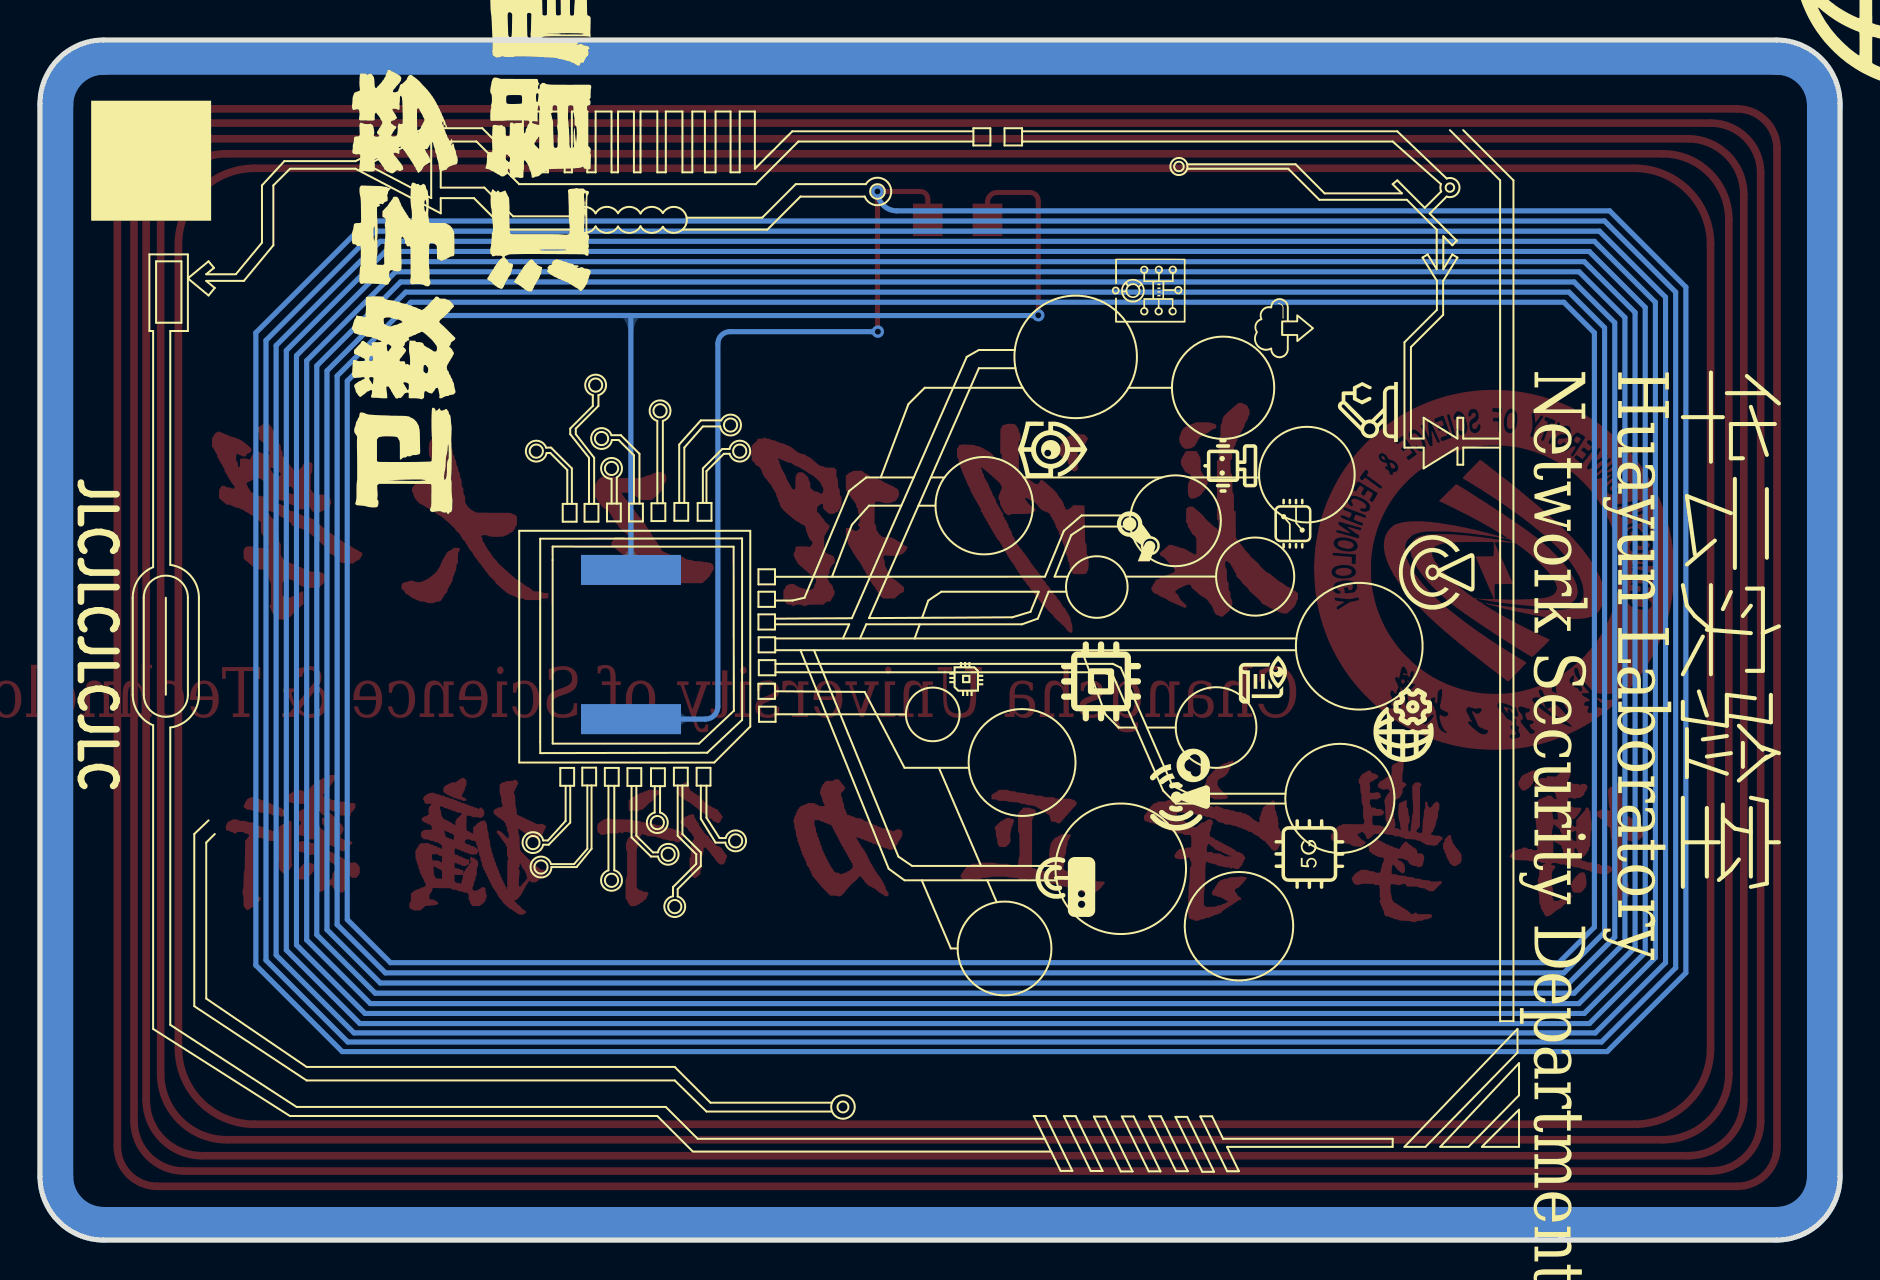
[diagram p10: board, bottom side, seen from below]

Outline 90 x 60 mm; copper layers: Top Layer, Bottom Layer. Coordinates in mm from the lower left corner of the outline.
Outline path: 0,56.82 arc(0.93,59.07) 3.18,60 86.82,60 arc(89.07,59.07) 90,56.82 90,3.18 arc(89.07,0.93) 86.82,0 3.18,0 arc(0.93,0.93) 0,3.18 0,56.82
Stack: Top Layer 0.035mm - / Dielectric1 1.51mm FR4 er 4.5 / Bottom Layer 0.035mm -

## Design rules (mm)
template: 自定义配置
spacing copperThickness1oz (default): track to track 0.203, other pairs 0.203 to 0.203
spacing copperThickness2oz: track to track 0.203, other pairs 0.152 to 0.3
track width copperThickness1oz (default): min 0.127, default 0.254, max 2.54
track width copperThickness2oz: min 0.203, default 0.254, max 2.54
differential pair differentialPair (default): width min 0.127, default 0.254, max 2.54; gap min 0.152, default 0.152
via viaSize (default): diameter min 0.5, default 0.61, max 10; hole min 0.3, default 0.305, max 6.299

## Placement (name value [footprint] x y rotation side)
LED4  XL-3216SURC  [LED1206-R-RD_RED]  44.12 51.01 0 top
U1  -  [JLC-QRCODE-6x6]  84.44 53.97 180 bottom
U1#2  -  [CUID芯片5×8mm]  60.45 29.77 90 bottom

## Footprints (pads in the part's own frame, mm; a bottom-side part is the same pattern mirrored in y, then rotated)
CUID芯片5×8mm
  rect 1.5x5 smd: 1(-3.729,0) 2(3.729,0)
LED1206-R-RD_RED
  rect 1.485x1.62 smd: 1(1.492,0) 2(-1.492,0)

## Nets
$1N1895: LED4.1 LED4.2 U1#2.1 U1#2.2

## Via types
v1: diameter 0.61, hole 0.305, Top Layer to Bottom Layer, 3 vias

## Routing (per net, layer and track width the routed paths; a pad name or vN(x,y) marks a point on that pad's centre or on a via; arc(x,y) is an arc through that point)
$1N1895: length 2079.2
  Top Layer w0.254: v1(40.09,46.24) 40.09,51.95 arc(40.21,52.25) 40.51,52.38 42.14,52.38 arc(42.48,52.23) 42.63,51.89 LED4.2 ; v1(48.11,45.42) 48.13,45.44 v1(48.13,52.43) 45.99,52.43 arc(45.72,52.32) 45.61,52.05 LED4.1
  Bottom Layer w0.254: v1(48.11,45.42) 55.5,45.42 arc(55.93,45.24) 56.11,44.81 56.11,26.67 arc(56.29,26.23) 56.74,26.04 U1#2.1 ; 48.09,52.47 48.09,52.47 ; U1#2.2 60.46,33.51 60.46,46.22 71.36,46.22 74.64,42.95 74.64,16.02 72.48,13.87 14.06,13.87 12.28,15.64 12.28,45.36 13.8,46.89 71.46,46.89 75.14,43.2 75.14,15.77 72.73,13.36 13.8,13.36 11.77,15.39 11.77,45.62 13.55,47.39 71.72,47.39 75.65,43.46 75.65,15.52 72.99,12.85 13.55,12.85 11.26,15.14 11.26,45.87 13.3,47.9 71.97,47.9 76.16,43.71 76.16,15.26 73.24,12.34 13.3,12.34 10.75,14.88 10.75,46.12 13.04,48.41 72.22,48.41 76.67,43.96 76.67,15.01 73.48,11.82 13.05,11.82 10.25,14.63 10.25,46.38 12.79,48.92 72.48,48.92 77.18,44.22 77.18,14.75 73.75,11.33 12.79,11.33 9.74,14.37 9.74,46.63 12.53,49.43 72.73,49.43 77.68,44.47 77.68,14.5 74.01,10.82 12.53,10.82 9.23,14.12 9.23,46.89 12.28,49.93 72.99,49.93 78.19,44.73 78.19,14.25 74.3,10.35 12.23,10.35 8.72,13.87 8.72,47.14 12.03,50.44 73.24,50.44 78.7,44.98 78.7,13.99 74.61,9.9 11.93,9.9 8.22,13.61 8.22,47.39 11.77,50.95 73.62,50.95 79.21,45.36 79.21,13.74 74.89,9.42 11.64,9.42 7.71,13.36 7.71,47.65 11.52,51.46 47.16,51.46 arc(47.84,51.74) v1(48.13,52.43) ; 60.46,46.22 40.1,46.22 v1(40.09,46.24)

Small or netless copper shapes (teardrops, artwork), in the pictures only: 54 on Top Layer, 6 on Bottom Layer

## Text on the board
Bottom Silkscreen Layer: JLCJLCJLCJLC | Huayun Laboratory / Network Security Department | 华云实验室
Top Layer: Changsha University of Science & Technology
Top Solder Mask Layer: Changsha University of Science & Technology
